# EAGLE design base_pwr1.0 (EAGLE 5.00)

## Sheet 1 of 2
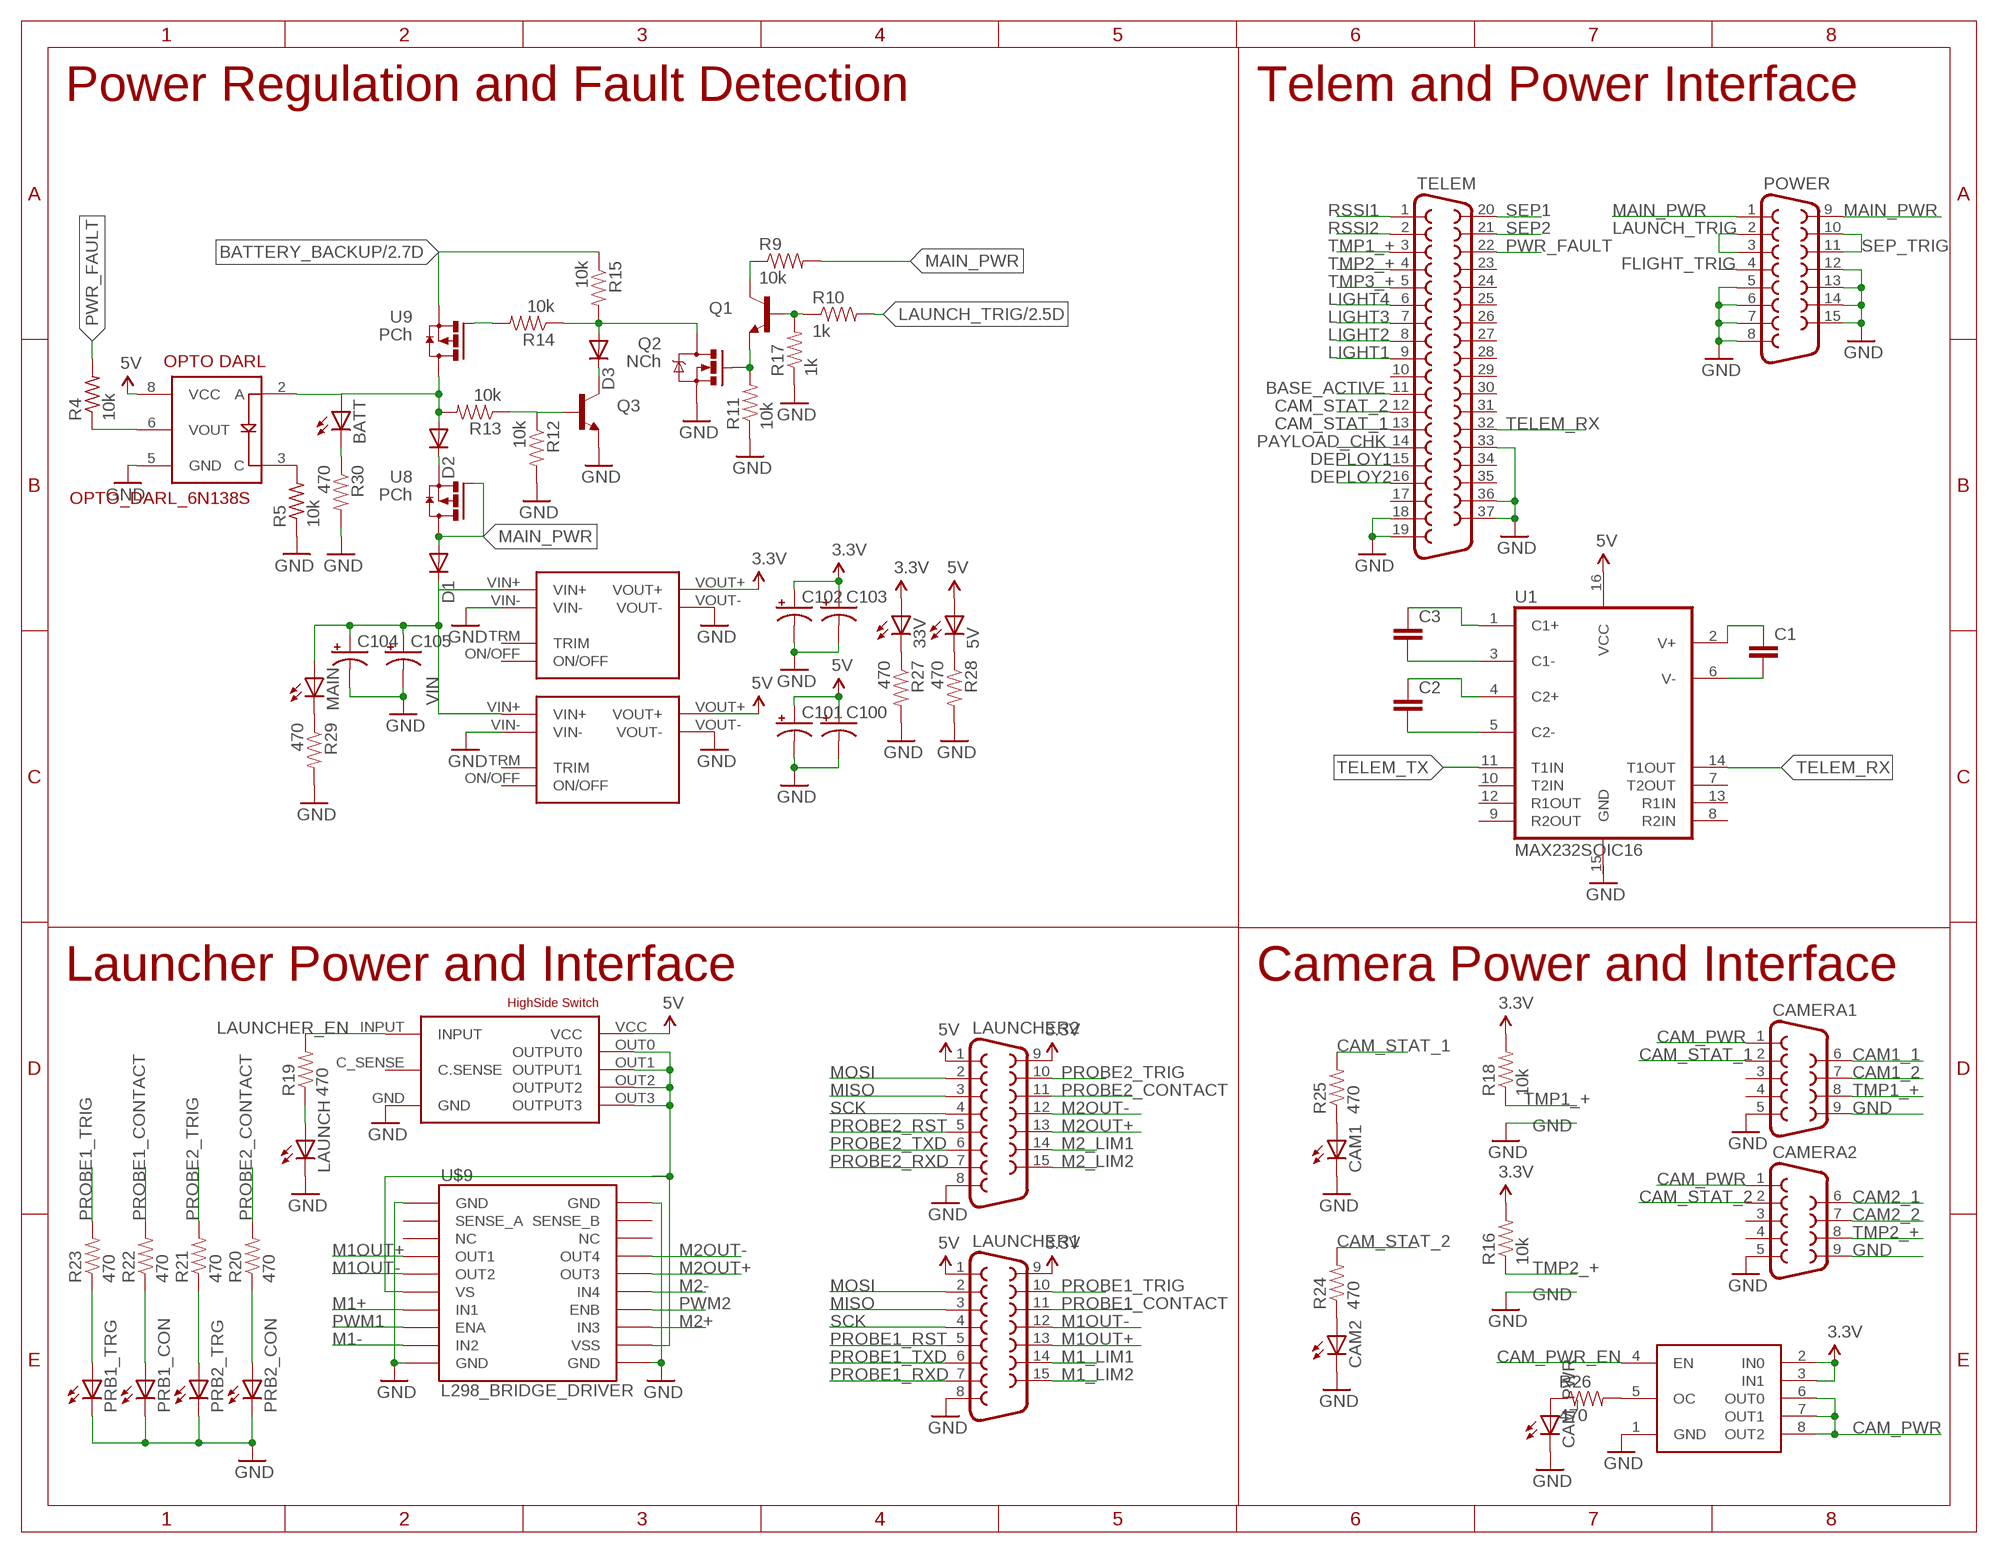
[diagram p0: schematic, sheet 1]

### Parts
3.3V  UEI15-033-Q12  [UEI15]
5.0V  UEI15-050-Q12  [UEI15]
5V  LEDCHIP-LED0805  [CHIP-LED0805]
33V  LEDCHIP-LED0805  [CHIP-LED0805]
BATT  LEDCHIP-LED0805  [CHIP-LED0805]
C1  CAP0805  [0805]
C2  CAP0805  [0805]
C3  CAP0805  [0805]
C100  CAP_POLF80  [NIPPON_F80]
C101  CAP_POLF80  [NIPPON_F80]
C102  CAP_POLF80  [NIPPON_F80]
C103  CAP_POLF80  [NIPPON_F80]
C104  CAP_POLF80  [NIPPON_F80]
C105  CAP_POLF80  [NIPPON_F80]
CAM1  LEDCHIP-LED0805  [CHIP-LED0805]
CAM2  LEDCHIP-LED0805  [CHIP-LED0805]
CAM_PWR  LEDCHIP-LED0805  [CHIP-LED0805]
CAMERA1  F09VB  [F09VB]
CAMERA2  F09VB  [F09VB]
D1  DIODE-SMC  [SMC]
D2  DIODE-SMC  [SMC]
D3  DIODESOD  [SOD-323]
LAUNCH  LEDCHIP-LED0805  [CHIP-LED0805]
LAUNCHER1  F15VB  [F15VB]
LAUNCHER2  F15VB  [F15VB]
MAIN  LEDCHIP-LED0805  [CHIP-LED0805]
POWER  F15VB  [F15VB]
PRB1_CON  LEDCHIP-LED0805  [CHIP-LED0805]
PRB1_TRG  LEDCHIP-LED0805  [CHIP-LED0805]
PRB2_CON  LEDCHIP-LED0805  [CHIP-LED0805]
PRB2_TRG  LEDCHIP-LED0805  [CHIP-LED0805]
Q1  TRANSISTOR_NPNSOT23-3  [SOT23-3]
Q2  NCh  MOSFET-NCHANNELSMD  [SOT23-3]
Q3  TRANSISTOR_NPNSOT23-3  [SOT23-3]
R4  10k  R-US_M0805  [M0805]
R5  10k  R-US_M0805  [M0805]
R9  10k  RESISTOR  [0805]
R10  1k  RESISTOR  [0805]
R11  10k  RESISTOR  [0805]
R12  10k  RESISTOR  [0805]
R13  10k  RESISTOR  [0805]
R14  10k  RESISTOR  [0805]
R15  10k  RESISTOR  [0805]
R16  10k  RESISTOR  [0805]
R17  1k  RESISTOR  [0805]
R18  10k  RESISTOR  [0805]
R19  470  RESISTOR  [0805]
R20  470  RESISTOR  [0805]
R21  470  RESISTOR  [0805]
R22  470  RESISTOR  [0805]
R23  470  RESISTOR  [0805]
R24  470  RESISTOR  [0805]
R25  470  RESISTOR  [0805]
R26  470  RESISTOR  [0805]
R27  470  RESISTOR  [0805]
R28  470  RESISTOR  [0805]
R29  470  RESISTOR  [0805]
R30  470  RESISTOR  [0805]
TELEM  F37VB  [F37VB]
U1  MAX232SOIC16  [SO016]
U5  OPTO_DARL_6N138S  [8-SMD]
U6  TPS2034D  [SO-08]
U7  VN920SP  [POWERS0-10]
U8  PCh  IRFR5505  [D-PAK_TO252AA]
U9  PCh  IRFR5505  [D-PAK_TO252AA]
U$9  L298_BRIDGE_DRIVER  [POWERSO20]

### Nets
3.3V: 3.3V.VOUT+ 33V.A C102.+ C103.+ LAUNCHER1.9 LAUNCHER2.9 R16.2 R18.2 U6.2(IN0) U6.3(IN1) ; also sheet 2
5V: 5.0V.VOUT+ 5V.A C100.+ C101.+ LAUNCHER1.1 LAUNCHER2.1 U1.16(VCC) U5.8(VCC) U7.VCC ; also sheet 2
BASE_ACTIVE: TELEM.11
BATTERY_BACKUP: R15.1 U9.3(S) ; also sheet 2
CAM1_1: CAMERA1.6 ; also sheet 2
CAM1_2: CAMERA1.7 ; also sheet 2
CAM2_1: CAMERA2.6 ; also sheet 2
CAM2_2: CAMERA2.7 ; also sheet 2
CAM_PWR: CAMERA1.1 CAMERA2.1 U6.6(OUT0) U6.7(OUT1) U6.8(OUT2)
CAM_PWR_EN: U6.4(EN) ; also sheet 2
CAM_STAT_1: CAMERA1.2 R25.2 TELEM.13 ; also sheet 2
CAM_STAT_2: CAMERA2.2 R24.2 TELEM.12 ; also sheet 2
DEPLOY1: TELEM.15 ; also sheet 2
DEPLOY2: TELEM.16 ; also sheet 2
FLIGHT_TRIG: POWER.4 ; also sheet 2
GND: 3.3V.VIN- 3.3V.VOUT- 5.0V.VIN- 5.0V.VOUT- C100.- C101.- C102.- C103.- C104.- C105.- CAM1.C CAM2.C CAM_PWR.C CAMERA1.5 CAMERA1.9 CAMERA2.5 CAMERA2.9 LAUNCH.C LAUNCHER1.8 LAUNCHER2.8 POWER.5 POWER.6 POWER.7 POWER.8 POWER.12 POWER.13 POWER.14 POWER.15 PRB1_CON.C PRB1_TRG.C PRB2_CON.C PRB2_TRG.C Q2.2(S) Q3.2(E) R5.1 R11.1 R12.2 R17.1 R27.2 R28.2 R29.2 R30.2 TELEM.18 TELEM.19 TELEM.33 TELEM.36 TELEM.37 U5.5(GND) U6.1(GND) U7.GND U$9.P$1(GND) U$9.P$10(GND) U$9.P$11(GND) U$9.P$20(GND) ; also sheet 2
LAUNCH_TRIG: POWER.2 POWER.3 R10.2 ; also sheet 2
LAUNCHER_EN: R19.2 U7.INPUT ; also sheet 2
LIGHT1: TELEM.9 ; also sheet 2
LIGHT2: TELEM.8 ; also sheet 2
LIGHT3: TELEM.7 ; also sheet 2
LIGHT4: TELEM.6 ; also sheet 2
M1+: U$9.P$7(IN1) ; also sheet 2
M1-: U$9.P$9(IN2) ; also sheet 2
M1_LIM1: LAUNCHER1.14 ; also sheet 2
M1_LIM2: LAUNCHER1.15 ; also sheet 2
M1OUT+: LAUNCHER1.13 U$9.P$4(OUT1)
M1OUT-: LAUNCHER1.12 U$9.P$5(OUT2)
M2+: U$9.P$13(IN3) ; also sheet 2
M2-: U$9.P$15(IN4) ; also sheet 2
M2_LIM1: LAUNCHER2.14 ; also sheet 2
M2_LIM2: LAUNCHER2.15 ; also sheet 2
M2OUT+: LAUNCHER2.13 U$9.P$16(OUT3)
M2OUT-: LAUNCHER2.12 U$9.P$17(OUT4)
MAIN_PWR: D1.A POWER.1 POWER.9 R9.2 U8.1(G) U8.4(D)
MISO: LAUNCHER1.3 LAUNCHER2.3 ; also sheet 2
MOSI: LAUNCHER1.2 LAUNCHER2.2 ; also sheet 2
N$1: R26.2 U6.5(OC)
N$2: CAM_PWR.A R26.1
N$3: CAM1.A R25.1
N$4: CAM2.A R24.1
N$6: Q1.2(E) Q2.1(G) R11.2
N$7: R5.2 U5.3(C)
N$8: D2.C U8.3(S)
N$9: R4.1 U5.6(VOUT)
N$16: Q1.3(C) R9.1
N$18: Q1.1(B) R10.1 R17.2
N$19: D3.1(C) Q3.3(C)
N$23: R14.2 U9.1(G)
N$25: U7.OUT0(OUTPUT0) U7.OUT1(OUTPUT1) U7.OUT2(OUTPUT2) U7.OUT3(OUTPUT3) U$9.P$6(VS) U$9.P$12(VSS)
N$26: Q3.1(B) R12.1 R13.1
N$44: D3.2(A) Q2.3(D) R14.1 R15.2
N$48: 33V.C R27.1
N$49: 5V.C R28.1
N$50: MAIN.C R29.1
N$51: BATT.C R30.1
N$52: LAUNCH.A R19.1
N$54: C3.1 U1.1(C1+)
N$55: C3.2 U1.3(C1-)
N$56: C2.2 U1.5(C2-)
N$57: C2.1 U1.4(C2+)
N$58: C1.1 U1.2(V+)
N$59: C1.2 U1.6(V-)
N$60: PRB1_TRG.A R23.1
N$61: PRB1_CON.A R22.1
N$62: PRB2_TRG.A R21.1
N$63: PRB2_CON.A R20.1
PAYLOAD_CHK: TELEM.14 ; also sheet 2
PROBE1_CONTACT: LAUNCHER1.11 R22.2 ; also sheet 2
PROBE1_RST: LAUNCHER1.5 ; also sheet 2
PROBE1_RXD: LAUNCHER1.7 ; also sheet 2
PROBE1_TRIG: LAUNCHER1.10 R23.2 ; also sheet 2
PROBE1_TXD: LAUNCHER1.6 ; also sheet 2
PROBE2_CONTACT: LAUNCHER2.11 R20.2 ; also sheet 2
PROBE2_RST: LAUNCHER2.5 ; also sheet 2
PROBE2_RXD: LAUNCHER2.7 ; also sheet 2
PROBE2_TRIG: LAUNCHER2.10 R21.2 ; also sheet 2
PROBE2_TXD: LAUNCHER2.6 ; also sheet 2
PWM1: U$9.P$8(ENA) ; also sheet 2
PWM2: U$9.P$14(ENB) ; also sheet 2
PWR_FAULT: R4.2 TELEM.22 ; also sheet 2
RSSI1: TELEM.1 ; also sheet 2
RSSI2: TELEM.2 ; also sheet 2
SCK: LAUNCHER1.4 LAUNCHER2.4 ; also sheet 2
SEP1: TELEM.20 ; also sheet 2
SEP2: TELEM.21 ; also sheet 2
SEP_TRIG: BATT.A D2.A POWER.10 POWER.11 R13.2 U5.2(A) U9.4(D) ; also sheet 2
TELEM_RX: TELEM.32 U1.14(T1OUT)
TELEM_TX: U1.11(T1IN) ; also sheet 2
TMP1_+: CAMERA1.8 R18.1 TELEM.3
TMP2_+: CAMERA2.8 R16.1 TELEM.4
TMP3_+: TELEM.5
VIN: 3.3V.VIN+ 5.0V.VIN+ C104.+ C105.+ D1.C MAIN.A
Unconnected: 3.3V.ON/OFF 3.3V.TRM(TRIM) 5.0V.ON/OFF 5.0V.TRM(TRIM) CAMERA1.3 CAMERA1.4 CAMERA2.3 CAMERA2.4 TELEM.10 TELEM.17 TELEM.23 TELEM.24 TELEM.25 TELEM.26 TELEM.27 TELEM.28 TELEM.29 TELEM.30 TELEM.31 TELEM.34 TELEM.35 U1.7(T2OUT) U1.8(R2IN) U1.9(R2OUT) U1.10(T2IN) U1.12(R1OUT) U1.13(R1IN) U1.15(GND) U7.C_SENSE(C.SENSE) U$9.P$2(SENSE_A) U$9.P$3(NC) U$9.P$18(NC) U$9.P$19(SENSE_B)

### Notes on the sheet
- Power Regulation and Fault Detection | Telem and Power Interface
- Launcher Power and Interface | Camera Power and Interface

## Sheet 2 of 2
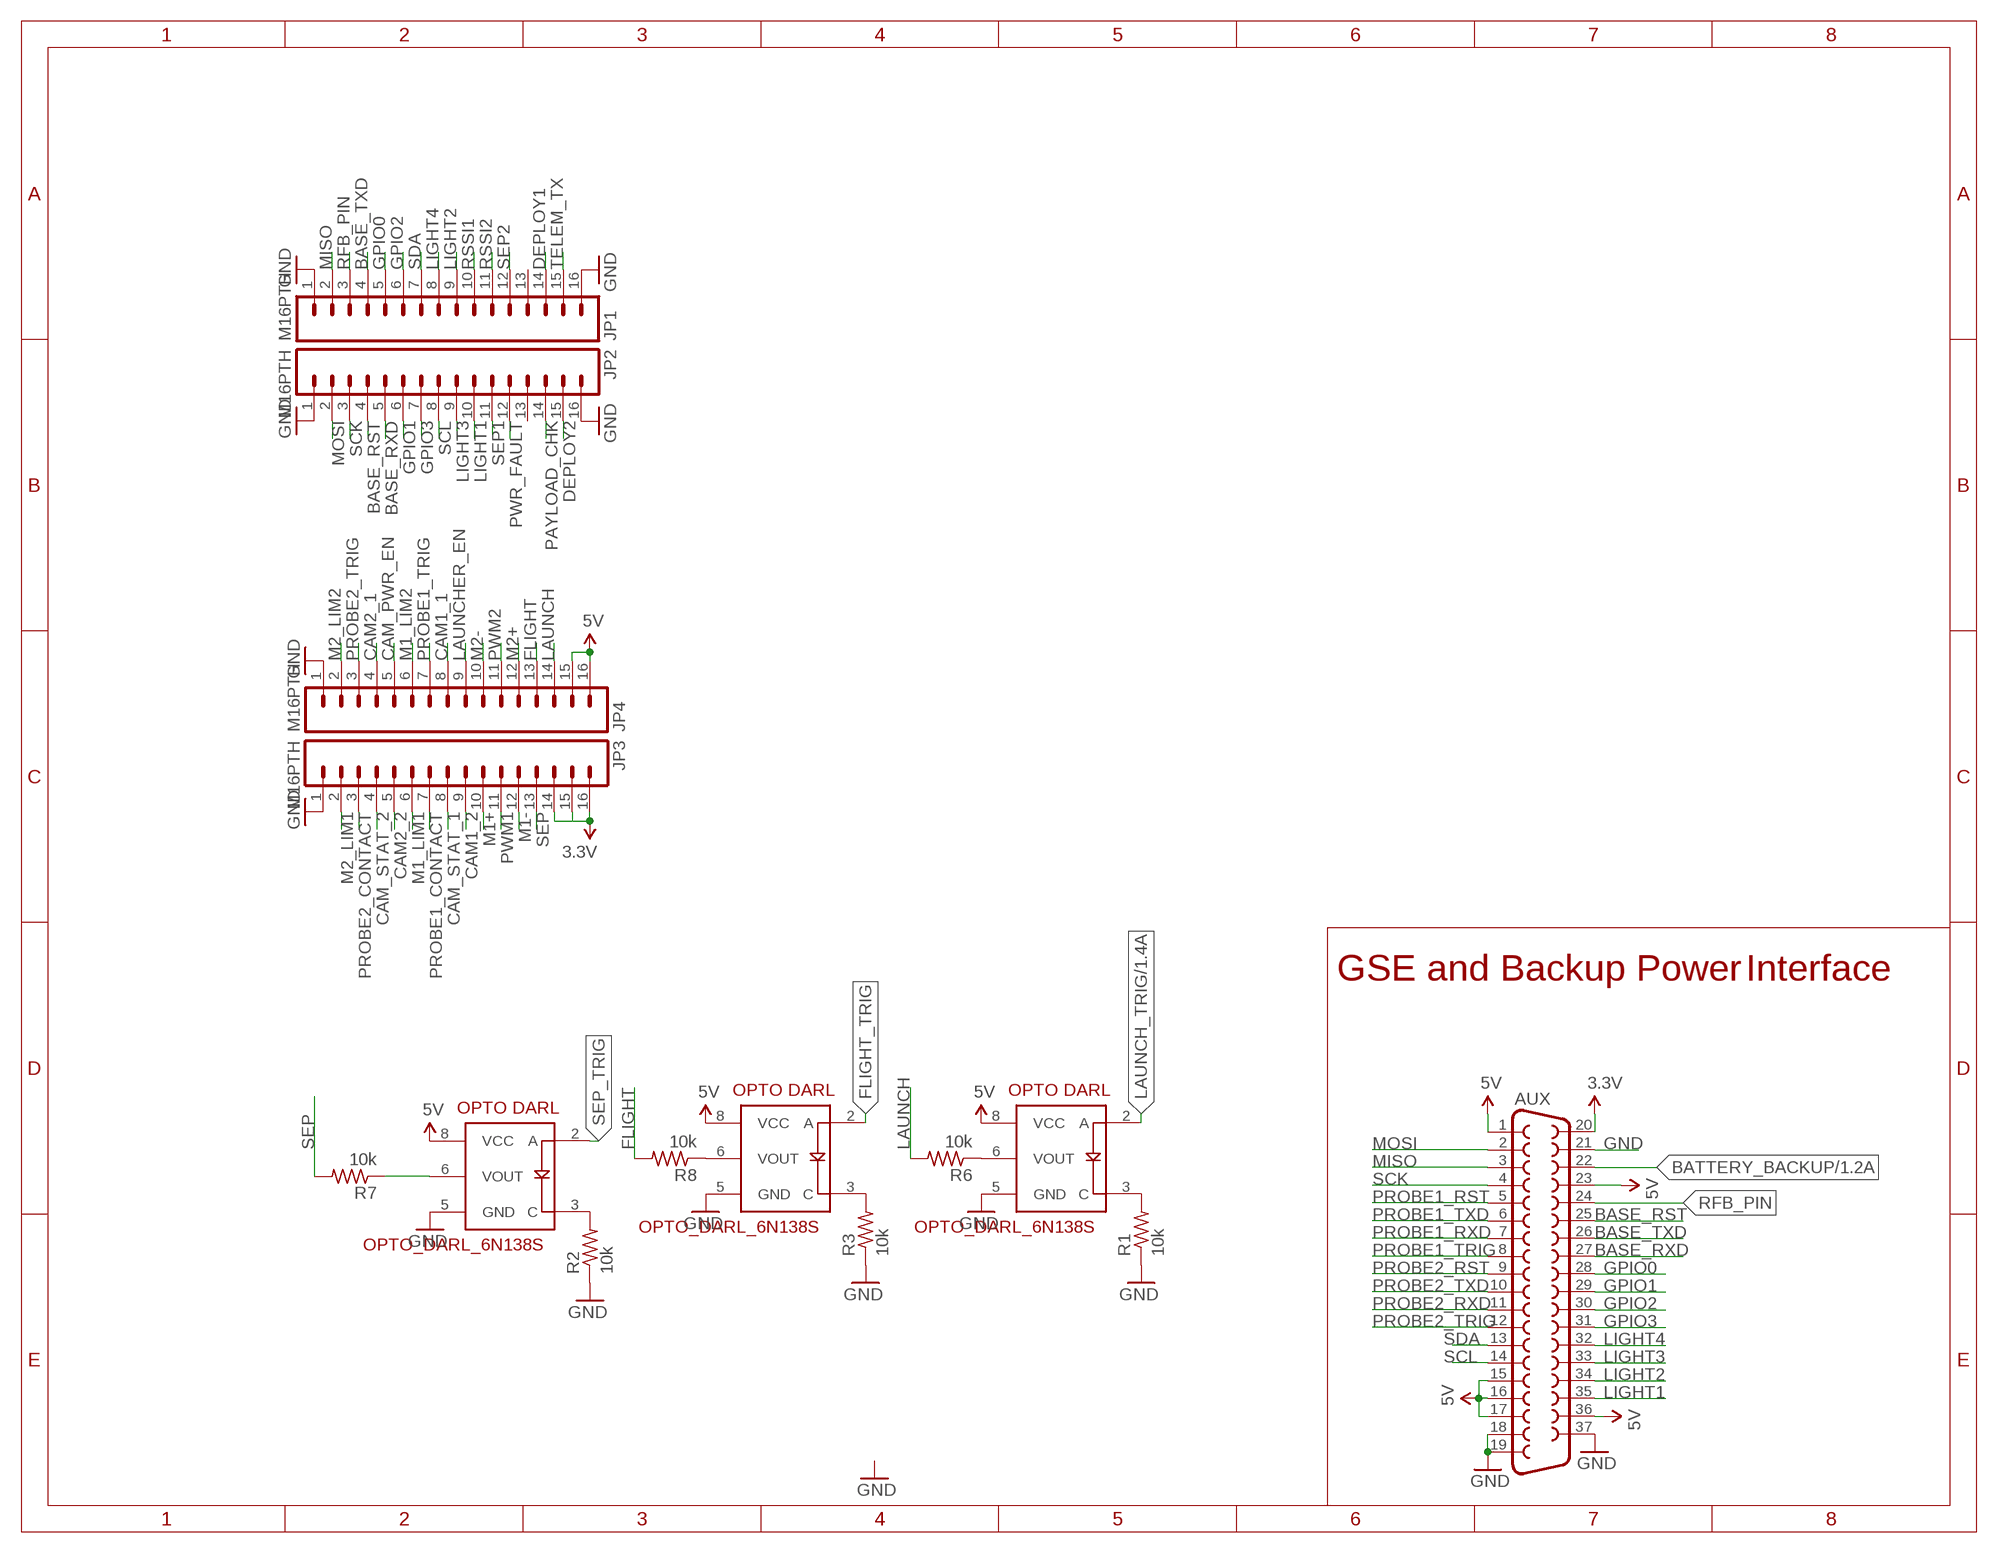
[diagram p1: schematic, sheet 2]

### Parts
AUX  F37VB  [F37VB]
JP1  M16PTH  [1X16]
JP2  M16PTH  [1X16]
JP3  M16PTH  [1X16]
JP4  M16PTH  [1X16]
R1  10k  R-US_M0805  [M0805]
R2  10k  R-US_M0805  [M0805]
R3  10k  R-US_M0805  [M0805]
R6  10k  R-US_M0805  [M0805]
R7  10k  R-US_M0805  [M0805]
R8  10k  R-US_M0805  [M0805]
U2  OPTO_DARL_6N138S  [8-SMD]
U3  OPTO_DARL_6N138S  [8-SMD]
U4  OPTO_DARL_6N138S  [8-SMD]

### Nets
3.3V: AUX.20 JP3.14 JP3.15 JP3.16 ; also sheet 1
5V: AUX.1 AUX.15 AUX.16 AUX.17 AUX.23 AUX.36 JP4.15 JP4.16 U2.8(VCC) U3.8(VCC) U4.8(VCC) ; also sheet 1
BASE_RST: AUX.25 JP2.4
BASE_RXD: AUX.27 JP2.5
BASE_TXD: AUX.26 JP1.4
BATTERY_BACKUP: AUX.22 ; also sheet 1
CAM1_1: JP4.8 ; also sheet 1
CAM1_2: JP3.9 ; also sheet 1
CAM2_1: JP4.4 ; also sheet 1
CAM2_2: JP3.5 ; also sheet 1
CAM_PWR_EN: JP4.5 ; also sheet 1
CAM_STAT_1: JP3.8 ; also sheet 1
CAM_STAT_2: JP3.4 ; also sheet 1
DEPLOY1: JP1.14 ; also sheet 1
DEPLOY2: JP2.15 ; also sheet 1
FLIGHT: JP4.13 R8.2
FLIGHT_TRIG: U4.2(A) ; also sheet 1
GND: AUX.18 AUX.19 AUX.21 AUX.37 JP1.1 JP1.16 JP2.1 JP2.16 JP3.1 JP4.1 R1.1 R2.1 R3.1 U2.5(GND) U3.5(GND) U4.5(GND) ; also sheet 1
GPIO0: AUX.28 JP1.5
GPIO1: AUX.29 JP2.6
GPIO2: AUX.30 JP1.6
GPIO3: AUX.31 JP2.7
LAUNCH: JP4.14 R6.2
LAUNCH_TRIG: U2.2(A) ; also sheet 1
LAUNCHER_EN: JP4.9 ; also sheet 1
LIGHT1: AUX.35 JP2.10 ; also sheet 1
LIGHT2: AUX.34 JP1.9 ; also sheet 1
LIGHT3: AUX.33 JP2.9 ; also sheet 1
LIGHT4: AUX.32 JP1.8 ; also sheet 1
M1+: JP3.10 ; also sheet 1
M1-: JP3.12 ; also sheet 1
M1_LIM1: JP3.6 ; also sheet 1
M1_LIM2: JP4.6 ; also sheet 1
M2+: JP4.12 ; also sheet 1
M2-: JP4.10 ; also sheet 1
M2_LIM1: JP3.2 ; also sheet 1
M2_LIM2: JP4.2 ; also sheet 1
MISO: AUX.3 JP1.2 ; also sheet 1
MOSI: AUX.2 JP2.2 ; also sheet 1
N$38: R1.2 U2.3(C)
N$39: R3.2 U4.3(C)
N$40: R2.2 U3.3(C)
N$41: R7.1 U3.6(VOUT)
N$43: R6.1 U2.6(VOUT)
N$64: R8.1 U4.6(VOUT)
PAYLOAD_CHK: JP2.14 ; also sheet 1
PROBE1_CONTACT: JP3.7 ; also sheet 1
PROBE1_RST: AUX.5 ; also sheet 1
PROBE1_RXD: AUX.7 ; also sheet 1
PROBE1_TRIG: AUX.8 JP4.7 ; also sheet 1
PROBE1_TXD: AUX.6 ; also sheet 1
PROBE2_CONTACT: JP3.3 ; also sheet 1
PROBE2_RST: AUX.9 ; also sheet 1
PROBE2_RXD: AUX.11 ; also sheet 1
PROBE2_TRIG: AUX.12 JP4.3 ; also sheet 1
PROBE2_TXD: AUX.10 ; also sheet 1
PWM1: JP3.11 ; also sheet 1
PWM2: JP4.11 ; also sheet 1
PWR_FAULT: JP2.12 ; also sheet 1
RFB_PIN: AUX.24 JP1.3
RSSI1: JP1.10 ; also sheet 1
RSSI2: JP1.11 ; also sheet 1
SCK: AUX.4 JP2.3 ; also sheet 1
SCL: AUX.14 JP2.8
SDA: AUX.13 JP1.7
SEP: JP3.13 R7.2
SEP1: JP2.11 ; also sheet 1
SEP2: JP1.12 ; also sheet 1
SEP_TRIG: U3.2(A) ; also sheet 1
TELEM_TX: JP1.15 ; also sheet 1
Unconnected: JP1.13 JP2.13

### Notes on the sheet
- GSE and Backup Power | Interface

## Library data of the parts
3.3V = muRata:UEI15-033-Q12; VOLTAGE: 3.3v
5.0V = muRata:UEI15-050-Q12; VOLTAGE: 5.0v
5V 33V BATT CAM1 CAM2 CAM_PWR LAUNCH MAIN PRB1_CON PRB1_TRG PRB2_CON PRB2_TRG = led:LED: LED OSRAM: - CHIPLED LG R971, LG N971, LY N971, LG Q971, LY Q971, LO R971, LY R971 LH N974, LH R974 LS Q976, LO Q976, LY Q976 LO Q996 - Hyper CHIPLED LW Q18S LB Q993, LB Q99A, LB R99A - SideLED LS A670, LO A670, LY A670, LG A670, LP A670 LB A673, LV A673, LT A673, LW A673 LH A674 LY A675 LS A676, LA A676, LO A676, LY A676, LW A676 LS A679, LY A679, LG A679 - Hyper Micro SIDELED® LS Y876, LA Y876, LO Y876, LY Y876 LT Y87S - SmartLED LW L88C, LW L88S LB L89C, LB L89S, LG L890 LS L89K, LO L89K, LY L89K LS L896, LA L896, LO L896, LY L896 - TOPLED LS T670, LO T670, LY T670, LG T670, LP T670 LSG T670, LSP T670, LSY T670, LOP T670, LYG T670 LG T671, LOG T671, LSG T671 LB T673, LV T673, LT T673, LW T673 LH T674 LS T676, LA T676, LO T676, LY T676, LB T676, LH T676, LSB T676, LW T676 LB T67C, LV T67C, LT T67C, LS T67K, LO T67K, LY T67K, LW E67C LS E67B, LA E67B, LO E67B, LY E67B, LB E67C, LV E67C, LT E67C LW T67C LS T679, LY T679, LG T679 LS T770, LO T770, LY T770, LG T770, LP T770 LB T773, LV T773, LT T773, LW T773 LH T774 LS E675, LA E675, LY E675, LS T675 LS T776, LA T776, LO T776, LY T776, LB T776 LHGB T686 LT T68C, LB T68C - Hyper Mini TOPLED® LB M676 - Mini TOPLED Santana® LG M470 LS M47K, LO M47K, LY M47K Source: http://www.osram.convergy.de LUXEON: - LUMILED® LXK2-PW12-R00, LXK2-PW12-S00, LXK2-PW14-U00, LXK2-PW14-V00 LXK2-PM12-R00, LXK2-PM12-S00, LXK2-PM14-U00 LXK2-PE12-Q00, LXK2-PE12-R00, LXK2-PE12-S00, LXK2-PE14-T00, LXK2-PE14-U00 LXK2-PB12-K00, LXK2-PB12-L00, LXK2-PB12-M00, LXK2-PB14-N00, LXK2-PB14-P00, LXK2-PB14-Q00 LXK2-PR12-L00, LXK2-PR12-M00, LXK2-PR14-Q00, LXK2-PR14-R00 LXK2-PD12-Q00, LXK2-PD12-R00, LXK2-PD12-S00 LXK2-PH12-R00, LXK2-PH12-S00 LXK2-PL12-P00, LXK2-PL12-Q00, LXK2-PL12-R00 Source: www.luxeon.com KINGBRIGHT: KA-3528ASYC Source: www.kingbright.com
AUX TELEM = con-subd:F37: SUB-D
C1-C3 = SparkFun:CAP: Capacitor Standard 0603 ceramic capacitor, and 0.1" leaded capacitor.
C100-C105 = SparkFun:CAP_POL: Capacitor Polarized These are standard SMD and PTH capacitors. Normally 10uF, 47uF, and 100uF in electrolytic and tantalum varieties. Always verify the external diameter of the through hole cap, it varies with capacity, voltage, and manufacturer. The EIA devices should be standard.
CAMERA1 CAMERA2 = con-subd:F09: SUB-D
D1 D2 = diode:DIODE-: DIODE
D3 = SparkFun:DIODE: Diode These are standard reverse protection diodes and small signal diodes. SMA package can handle up to about 1A. SOD-323 can handle about 200mA. What the SOD-323 package when ordering, there are some mfgs out there that are 5-pin packages.
JP1-JP4 = SparkFun:M16
LAUNCHER1 LAUNCHER2 POWER = con-subd:F15: SUB-D
Q1 Q3 = SparkFun:TRANSISTOR_NPN: Transistor NPN BJT configuration in SOT23 package. MMBT2222 is the common NPN we use. Double check BCE configuration again layout.
Q2 = SparkFun:MOSFET-NCHANNEL
R1-R8 = rcl:R-US_: RESISTOR, American symbol
R9-R30 = SparkFun:RESISTOR: Resistor Basic schematic elements and footprints for 0603, 1206, and PTH 1/10th watt (small) resistors.
U1 = SparkFun:MAX232: RS232 Transceiver Very common IC. This is generically called 'MAX232', but works with the 3V equivalent MAX3232 generic ICs. Field tested and mother approved. Spark Fun Electronics SKU : COM-00316 (DIP) and COM-00589 (SMD)
U2-U5 = SparkFun:OPTO_DARL_6N138S
U6 = texas:TPS2034D
U7 = rocketsat:VN920SP
U8 U9 = transistor-power:IRFR5505
U$9 = SparkFun:L298_BRIDGE_DRIVER

## Board
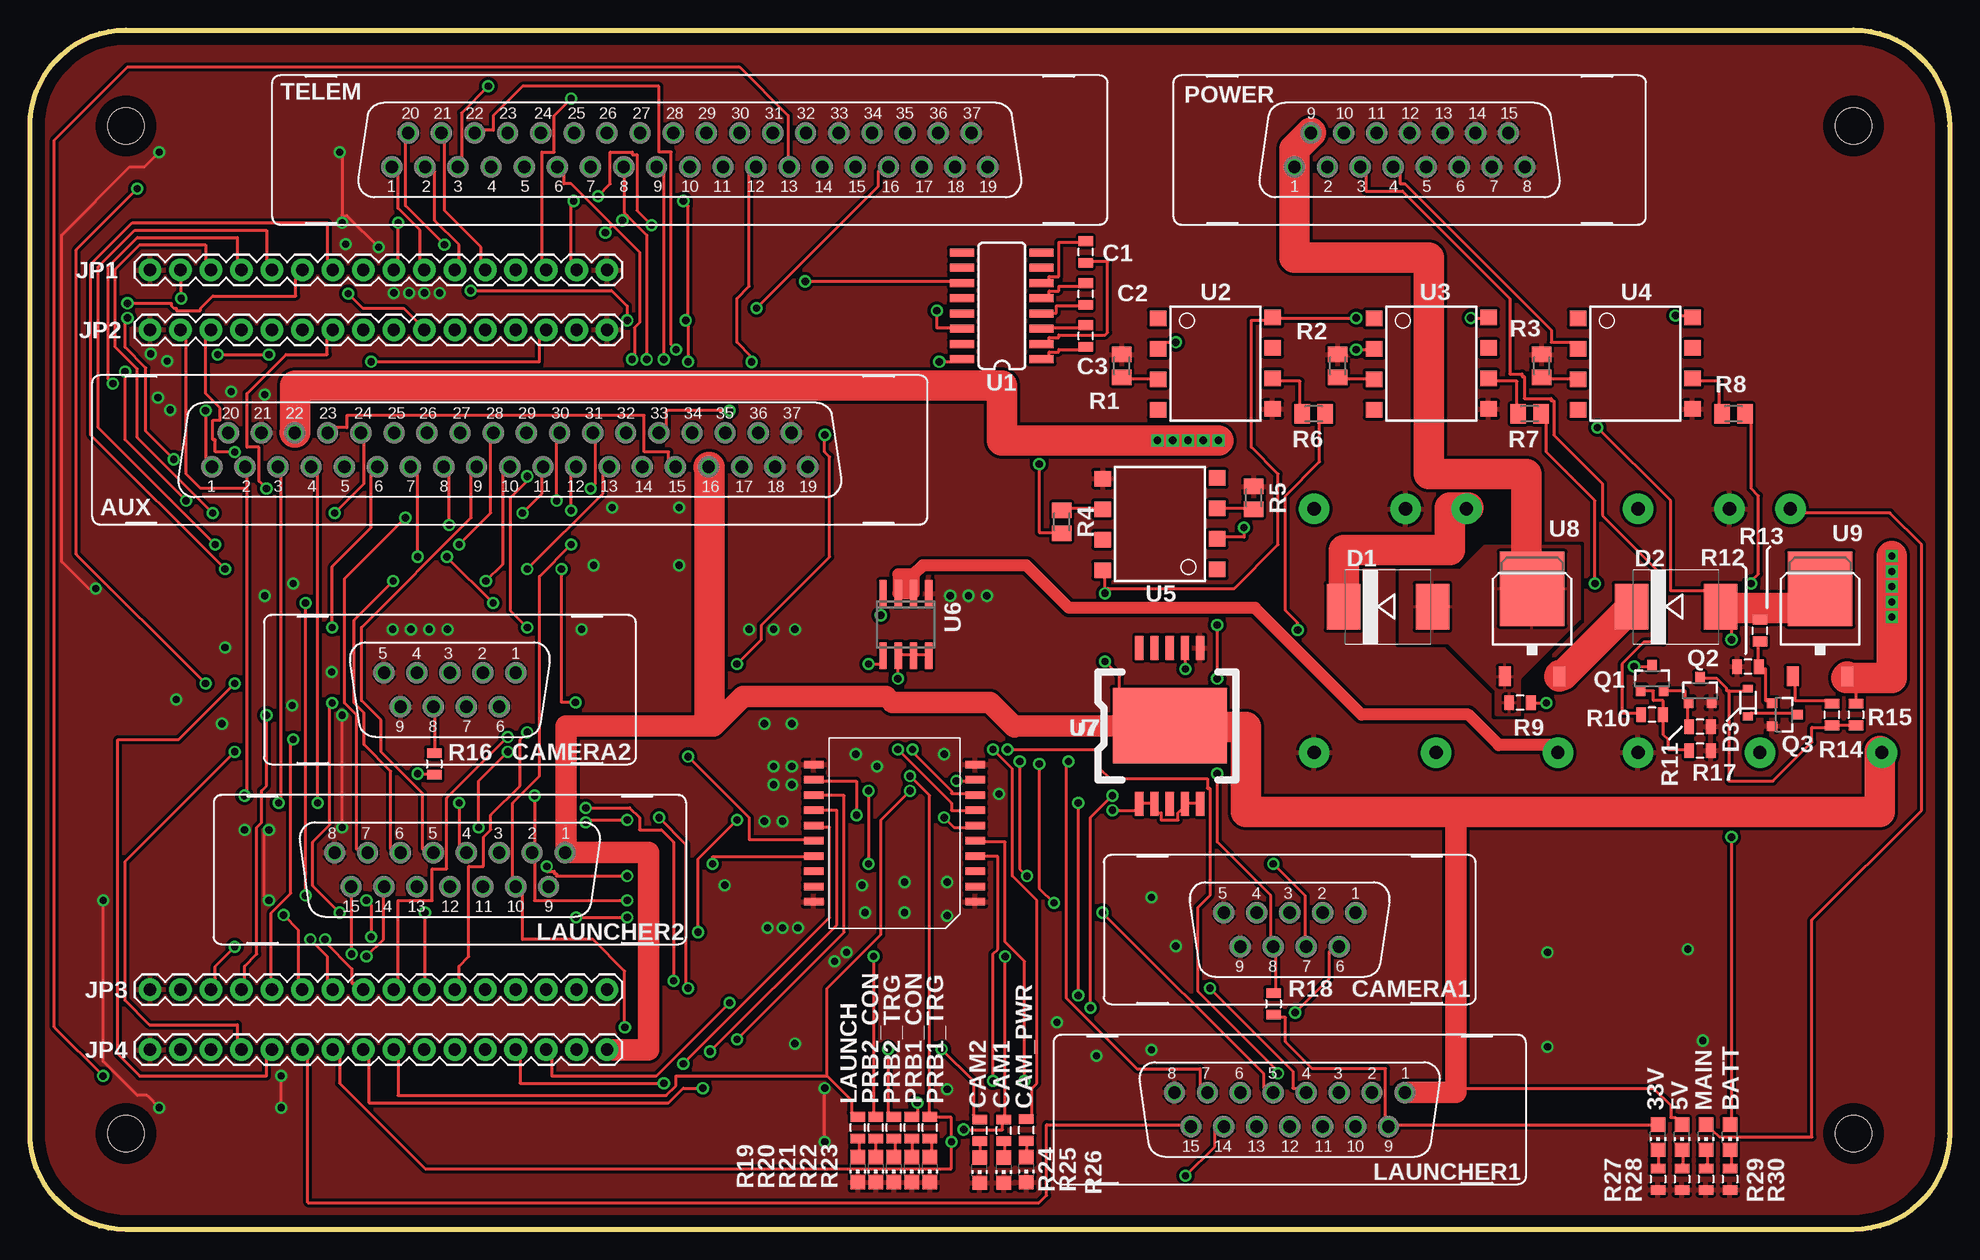
[diagram p2: board, top side]
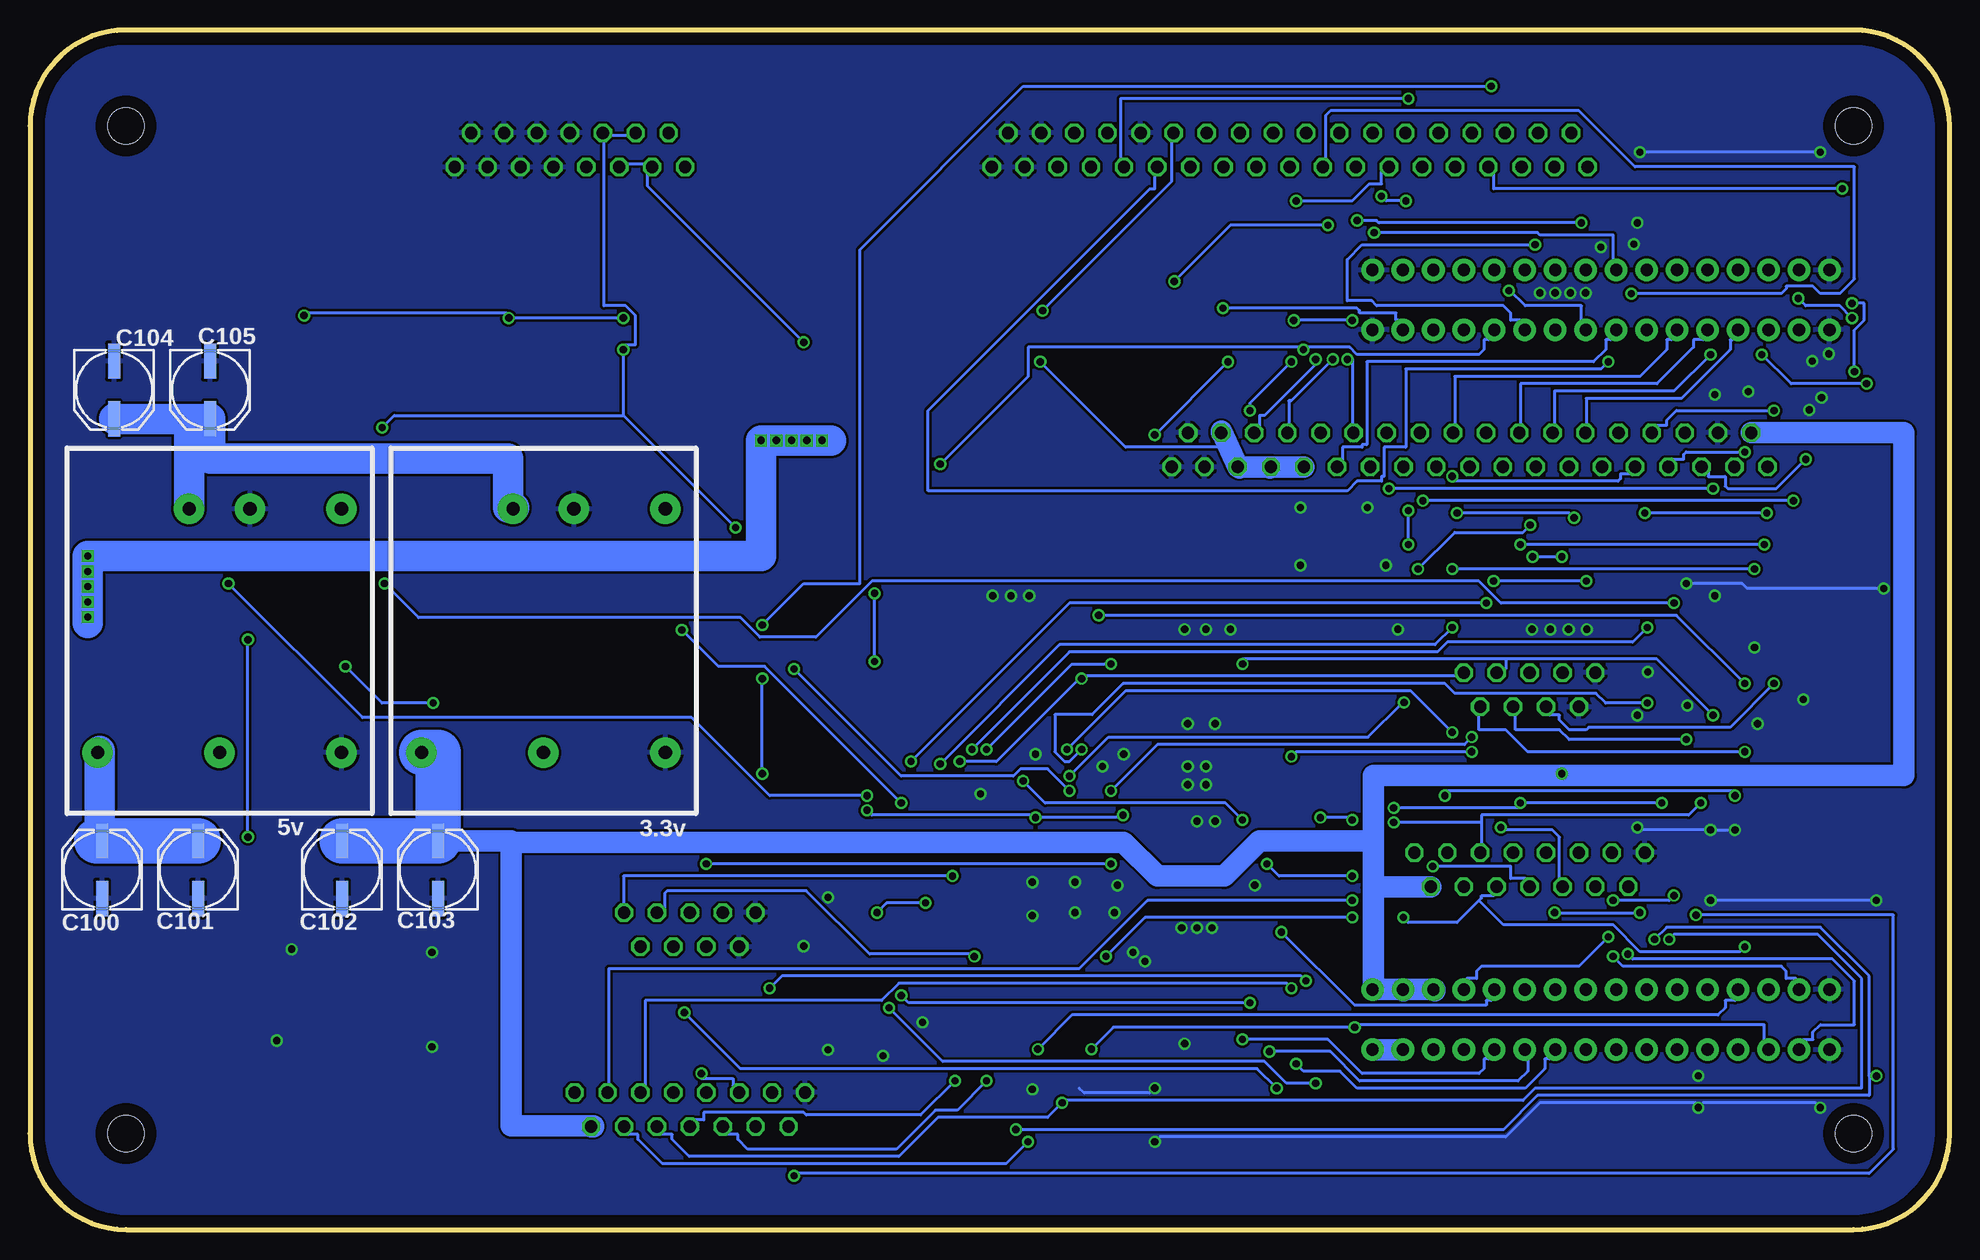
[diagram p3: board, bottom side, seen from below]

Size 160 x 100 mm. Coordinates in mm from the lower left corner, seen from the top.
Outline: 8,0 arc-90 0,8 0,92 arc-90 8,100 152,100 arc-90 160,92 160,8 arc-90 152,0 8,0
Copper layers (1*16): Top 0.035mm / dielectric 1.5mm / Bottom 0.035mm
Design rules "default *": minimum track width 10mil, minimum drill 24mil, track to track 8mil, track to pad 8mil, pad to pad 8mil, via to via 8mil, smd to smd 8mil, copper to edge 40mil, drill to drill 8mil, minimum pad ring 10mil, minimum via ring 8mil, stop-mask expansion 4mil, vias tented up to drill 25mil, thermal gap 10mil
Holes 3 mm at 8,8 152,8 152,92 8,92

### Footprints (pad centres in the part's own frame; a part is rotated, then mirrored left to right if it is on the bottom)
UEI15 = drill 1.1 pad 2.54 round: ON/OFF 10.16,-10.16; TRM -10.16,0; VIN+ 10.16,2.54; VIN- 10.16,-2.54; VOUT+ -10.16,10.16; VOUT- -10.16,-10.16
CHIP-LED0805 = smd 1.2 x 1.2: A 0,-1.05; C 0,1.05
F37VB = drill 1.016 octagon: 1 -24.841,-1.422; 2 -22.073,-1.422; 3 -19.329,-1.422; 4 -16.561,-1.422; 5 -13.792,-1.422; 6 -11.049,-1.422; 7 -8.28,-1.422; 8 -5.512,-1.422; 9 -2.769,-1.422; 10 0,-1.422; 11 2.769,-1.422; 12 5.512,-1.422; 13 8.28,-1.422; 14 11.049,-1.422; 15 13.818,-1.422; 16 16.561,-1.422; 17 19.329,-1.422; 18 22.098,-1.422; 19 24.841,-1.422; 20 -23.47,1.422; 21 -20.701,1.422; 22 -17.932,1.422; 23 -15.189,1.422; 24 -12.421,1.422; 25 -9.652,1.422; 26 -6.909,1.422; 27 -4.14,1.422; 28 -1.372,1.422; 29 1.372,1.422; 30 4.14,1.422; 31 6.909,1.422; 32 9.677,1.422; 33 12.421,1.422; 34 15.189,1.422; 35 17.958,1.422; 36 20.701,1.422; 37 23.47,1.422
0805 = smd 0.8 x 1.2: 1 -0.9,0; 2 0.9,0
NIPPON_F80 = smd 2.95 x 1: + 2.4,0; - -2.4,0
F09VB = drill 1.016 octagon: 1 -5.486,-1.422; 2 -2.743,-1.422; 3 0,-1.422; 4 2.743,-1.422; 5 5.486,-1.422; 6 -4.115,1.422; 7 -1.372,1.422; 8 1.372,1.422; 9 4.115,1.422
SMC = smd 2.8 x 3.8: A 3.7,0; C -3.7,0
SOD-323 = smd 0.63 x 0.83: 1 -1.15,0; 2 1.15,0
1X16 = drill 1.016 pad 1.88 round: 1 0,0; 2 2.54,0; 3 5.08,0; 4 7.62,0; 5 10.16,0; 6 12.7,0; 7 15.24,0; 8 17.78,0; 9 20.32,0; 10 22.86,0; 11 25.4,0; 12 27.94,0; 13 30.48,0; 14 33.02,0; 15 35.56,0; 16 38.1,0
F15VB = drill 1.016 octagon: 1 -9.601,-1.422; 2 -6.858,-1.422; 3 -4.115,-1.422; 4 -1.372,-1.422; 5 1.372,-1.422; 6 4.115,-1.422; 7 6.858,-1.422; 8 9.601,-1.422; 9 -8.23,1.422; 10 -5.486,1.422; 11 -2.743,1.422; 12 0,1.422; 13 2.743,1.422; 14 5.486,1.422; 15 8.23,1.422
SOT23-3 = smd 0.8 x 0.9: 1 -0.95,-1; 2 0.95,-1; 3 0,1.1
M0805 = smd 1.3 x 1.6: 1 -0.95,0; 2 0.95,0
SO016 = smd 0.66 x 2.032: 1 -4.445,-3.315; 2 -3.175,-3.315; 3 -1.905,-3.315; 4 -0.635,-3.315; 5 0.635,-3.315; 6 1.905,-3.315; 7 3.175,-3.315; 8 4.445,-3.315; 9 4.445,3.315; 10 3.175,3.315; 11 1.905,3.315; 12 0.635,3.315; 13 -0.635,3.315; 14 -1.905,3.315; 15 -3.175,3.315; 16 -4.445,3.315
8-SMD = smd 1.3 x 1.4: 1 -3.96,-4.96; 2 -1.42,-4.96; 3 1.12,-4.96; 4 3.66,-4.96; 5 3.59,4.58; 6 1.05,4.58; 7 -1.49,4.58; 8 -4.03,4.58
SO-08 = smd 0.6 x 2.2: 1 -1.905,-2.6; 2 -0.635,-2.6; 3 0.635,-2.6; 4 1.905,-2.6; 5 1.905,2.6; 6 0.635,2.6; 7 -0.635,2.6; 8 -1.905,2.6
POWERS0-10 = smd 2 x 0.7: C_SENSE -6.5,0; GND -6.5,2.54; INPUT -6.5,1.27; NC0 6.5,0; NC1 -6.5,-2.54; NC2 -6.5,-1.27; OUT0 6.5,-2.54; OUT1 6.5,-1.27; OUT2 6.5,1.27; OUT3 6.5,2.54 | smd 6.3 x 9.5: VCC 0,0
D-PAK_TO252AA = smd 1 x 1.6: 1 -2.28,-4.8; 3 2.28,-4.8 | smd 5.4 x 6.2: 4 0,2.5
POWERSO20 = smd 1.651 x 0.635: P$1 -6.731,5.715; P$2 -6.731,4.445; P$3 -6.731,3.175; P$4 -6.731,1.905; P$5 -6.731,0.635; P$6 -6.731,-0.635; P$7 -6.731,-1.905; P$8 -6.731,-3.175; P$9 -6.731,-4.445; P$10 -6.731,-5.715; P$11 6.731,-5.715; P$12 6.731,-4.445; P$13 6.731,-3.175; P$14 6.731,-1.905; P$15 6.731,-0.635; P$16 6.731,0.635; P$17 6.731,1.905; P$18 6.731,3.175; P$19 6.731,4.445; P$20 6.731,5.715

### Placement (x,y rotation side)
3.3V  117.2,49.92 90 bottom
5.0V  144.2,49.92 90 bottom
5V  137.7,7.7 180 top
33V  135.7,7.7 180 top
AUX  40,65 0 top
BATT  141.7,7.7 180 top
C1  88,81.5 90 top
C2  88,78 90 top
C3  88,74.5 90 top
C100  154,30 90 bottom
C101  146,30 90 bottom
C102  134,30 90 bottom
C103  126,30 90 bottom
C104  153,70 270 bottom
C105  145,70 270 bottom
CAM1  81.17,4.95 180 top
CAM2  79.15,4.95 180 top
CAM_PWR  83.05,4.99 180 top
CAMERA1  105,25 180 top
CAMERA2  35,45 180 top
D1  113.2,51.92 0 top
D2  137.2,51.92 0 top
D3  143.2,43.92 90 top
JP1  10,80 0 top
JP2  10,75 0 top
JP3  10,20 0 top
JP4  10,15 0 top
LAUNCH  69,5 180 top
LAUNCHER1  105,10 180 top
LAUNCHER2  35,30 180 top
MAIN  139.7,7.7 180 top
POWER  115,90 0 top
PRB1_CON  73.5,5 180 top
PRB1_TRG  75,5 180 top
PRB2_CON  70.5,5 180 top
PRB2_TRG  72,5 180 top
Q1  135.2,45.92 0 top
Q2  139.2,44.92 0 top
Q3  146.2,42.92 270 top
R1  91,72 270 top
R2  109,72 270 top
R3  126,72 270 top
R4  86,59 270 top
R5  102,61 270 top
R6  107,68 0 top
R7  125,68 0 top
R8  142,68 0 top
R9  124.2,43.92 180 top
R10  135.2,42.92 180 top
R11  139.2,41.92 180 top
R12  143.2,46.92 180 top
R13  144.2,49.92 90 top
R14  150.2,42.92 90 top
R15  152.2,42.92 270 top
R16  33.7,38.81 270 top
R17  139.2,39.92 180 top
R18  103.66,18.81 270 top
R19  69,8.5 90 top
R20  70.5,8.5 90 top
R21  72,8.5 90 top
R22  73.5,8.5 90 top
R23  75,8.5 90 top
R24  79.15,8.26 90 top
R25  81.17,8.26 90 top
R26  83.05,8.3 90 top
R27  135.7,4.2 270 top
R28  137.7,4.2 270 top
R29  139.7,4.2 270 top
R30  141.7,4.2 270 top
TELEM  55,90 0 top
U1  81,77 90 top
U2  99,72 270 top
U3  117,72 270 top
U4  134,72 270 top
U5  94,59 90 top
U6  73.01,50.44 180 top
U7  95,42 270 top
U8  125.2,50.92 0 top
U9  149.2,50.92 0 top
U$9  72.06,33.04 180 top

### Tracks (layer width: path | path; a pad name or v marks a point on that pad's centre or on a via)
3.3V  (via drill 0.6)
  Top 0.254: R18.2 104.24,17.68 104.65,17.68 104.65,15.65 106.88,13.41 112.98,13.41 112.98,9.14 LAUNCHER1.9 113.79,8.74 135.13,8.74 33V.A | v32.31,38 33.12,38 R16.2
  Top 1.016: U6.2 73.66,54.61 | 73.41,54.61 72.39,54.61 U6.3 73.41,53.04 73.41,54.61 | 73.66,54.61 73.41,54.61 | 3.3V.VOUT+ 127.39,39.76 127.51,39.88 127,40.39 122.43,40.39 119.89,42.93 111,42.93 102.11,51.82 86.61,51.82 83.06,55.37 74.42,55.37 73.66,54.61
  Bottom 0.254: 32.31,37.85 v32.31,38
  Bottom 1.778: JP3.15 45.52,20 45.52,19.91 | JP3.15 JP3.16 48.01,20 48.01,28.45 | 42.88,20 JP3.14 | JP3.15 42.88,20 | 42.88,20 42.88,19.91 | LAUNCHER2.9 48.01,28.58 48.01,28.45 | 120.14,32.4 119.89,32.4 119.89,8.64 113.03,8.64 113.03,8.58 LAUNCHER1.9 | 120.14,32.4 C102.+ | AUX.20 3.81,66.42 3.81,37.85 32.31,37.85 48.01,37.85 48.01,32.4 | 48.01,32.4 48.01,28.45 | 48.01,32.4 57.52,32.4 60.45,29.46 66.04,29.46 68.83,32.26 120.14,32.26 120.14,32.4
  Bottom 3.81: 3.3V.VOUT+ 125.98,39.76 125.98,32.4 | 125.98,32.4 C103.+ | C102.+ 125.98,32.4
5V  (via drill 0.6)
  Top 0.254: v110.54,76 104.24,76 U2.8 103.02,75.79 101.8,75.79 101.8,65.23 104.04,62.99 104.04,57.1 100.38,53.44 89.81,53.44 v89.61,53.03 89.61,54.46 U5.8 | v120.09,76 120.9,76 U3.8 | v137.16,76.2 137.97,76.2 U4.8 | v14.63,68.28 14.63,64.01 AUX.1 | 5V.A 137.16,9.35 136.75,9.35 136.75,10.36 135.33,11.79 118.87,11.79 | v89.61,47.35 90.83,46.13 90.83,45.11 U7.VCC | v75.79,72.34 76.81,72.34 U1.16 | AUX.23 25.4,66.85 26.42,66.85 26.42,67.87 51.21,67.87 51.21,64.82 53.24,64.82 53.24,64.01 AUX.15 | 56.64,42.88 56.69,42.88 56.69,42
  Top 1.778: U7.VCC 82.04,42 82.04,41.91 80.01,43.94 71.88,43.94 71.37,44.45 59.44,44.45 56.99,42 56.69,42 44.7,42 44.7,31.42 | 44.7,31.42 LAUNCHER2.1 | 44.7,31.42 51.56,31.42 51.56,14.99 48.01,14.99 48.01,15 JP4.16 | LAUNCHER1.1 118.87,11.42 118.87,11.79 118.87,34.8
  Top 2.54: AUX.16 56.64,63.58 56.64,42.88 56.64,42.42 | 118.62,34.8 101.35,34.8 101.35,41.91 95,41.91 U7.VCC | 118.62,34.8 118.87,34.8 | 118.62,34.8 154.18,34.8 154.18,39.88 154.3,39.76 5.0V.VOUT+
  Bottom 0.254: v110.54,76 v120.09,76 120.29,76.4 136.96,76.4 v137.16,76.2 | v14.63,68.28 22.76,68.28 23.57,67.46 23.57,67.06 24.38,67.06 AUX.23 | v89.61,47.35 v89.61,53.03 | v75.79,72.34 68.68,65.23 60.96,65.23 60.25,65.56
  Bottom 1.778: JP4.16 JP4.15 45.52,15 45.52,15.04 | AUX.16 AUX.15 | AUX.16 56.64,63.5 | AUX.16 59.1,63.58 59.18,63.5 59.26,63.58 AUX.17 60.25,65.56 60.71,66.55 AUX.36
  Bottom 2.54: C101.+ 154.18,32.4 154.18,39.88 154.3,39.76 5.0V.VOUT+
  Bottom 3.81: 153.92,32.4 C100.+ 154.18,32.4 154.43,32.4 | C101.+ 153.92,32.4 | 153.92,32.4 153.92,32.51
BASE_RST
  Bottom 0.254: AUX.25 30.28,67.06 30.28,69.29 22.35,69.29 18.29,73.36 18.29,74.17 18.09,74.17 JP2.4
BASE_RXD
  Bottom 0.254: AUX.27 35.76,67.06 35.76,70.51 24.38,70.51 21.34,73.56 21.34,74.17 20.52,74.17 JP2.5
BASE_TXD  (via drill 0.6)
  Top 0.254: v15.65,72.95 v19.91,72.95 | v6.91,70.51 6.5,70.92 6.5,80.26 8.94,82.7 17.27,82.7 17.27,80.87 JP1.4
  Bottom 0.254: v19.91,72.95 22.96,69.9 32.92,69.9 32.92,67.06 AUX.26 | v15.65,72.95 13.21,70.51 v6.91,70.51
BATTERY_BACKUP  (via drill 0.6)
  Top 0.254: R15.1 152.2,44.09 152.2,45.97
  Top 2.54: AUX.22 22.1,66.45 22.1,70.36 81.03,70.36 81.03,65.79 v93.98,65.79 v95.25,65.79 v96.52,65.79 v97.79,65.79 v99.06,65.79 | v155.19,56.13 v155.19,54.86 v155.19,53.59 v155.19,52.32 v155.19,51.05 155.19,45.97 152.2,45.97 151.48,45.97 | 151.48,45.97 151.38,45.97 | 151.48,45.97 U9.3
  Bottom 2.54: 93.22,65.79 v93.98,65.79 v95.25,65.79 v96.52,65.79 v97.79,65.79 v99.06,65.79 99.06,56.13 v155.19,56.13 | 155.19,50.55 v155.19,51.05 v155.19,52.32 v155.19,53.59 | v155.19,54.86 v155.19,53.59 | v155.19,56.13 v155.19,54.86 | v155.19,56.13 v155.19,54.86 | v155.19,54.86 v155.19,53.59
CAM1_1  (via drill 0.6)
  Top 0.254: v105.46,18.09 108.31,20.93 108.31,23.16 108.51,23.16 CAMERA1.6 | v56.08,11.79 54.46,11.79 53.24,10.57 28.25,10.57 28.25,14.22 JP4.8
  Bottom 0.254: v105.46,18.09 100.79,13.41 57.71,13.41 v56.08,11.79
CAM1_2  (via drill 0.6)
  Top 0.254: v103.63,30.48 106.27,27.84 106.27,24.18 CAMERA1.7 | v69.9,36.58 v69.9,30.48 | v39.83,41.05 34.75,35.97 34.75,30.07 33.53,30.07 33.53,27.43 30.68,27.43 30.68,20.93 JP3.9
  Bottom 0.254: v69.9,30.48 v103.63,30.48 | v69.9,36.58 66.04,40.44 40.44,40.44 v39.83,41.05
CAM2_1  (via drill 0.6)
  Top 0.254: v17.07,39.83 7.92,30.68 7.92,19.1 9.96,17.07 17.27,17.07 17.27,15.85 JP4.4
  Bottom 0.254: v17.07,39.83 35.15,39.83 36.98,41.66 39.22,41.66 39.22,42.88 CAMERA2.6
CAM2_2  (via drill 0.6)
  Top 0.254: v21.95,40.84 21.74,40.64 21.74,28.04 20.12,26.42 20.12,20.93 JP3.5
  Bottom 0.254: v21.95,40.84 31.7,40.84 32.51,41.66 36.17,41.66 36.17,42.88 CAMERA2.7
CAM_PWR  (via drill 0.6)
  Top 0.254: U6.8 74.78,47.95 73.76,47.95 U6.7 73.36,47.95 72.54,47.95 U6.6 72.34,46.94 v72.34,45.92 | v83.11,29.46 82.5,30.07 v82.5,39.01
  Bottom 0.254: CAMERA2.1 41.05,46.13 72.14,46.13 v72.34,45.92 72.75,45.72 79.45,39.01 v82.5,39.01 | v83.11,29.46 110.54,29.46 110.54,27.03 CAMERA1.1
CAM_PWR_EN  (via drill 0.6)
  Top 0.254: v70.92,51.21 70.92,52.02 U6.4 | v17.07,45.52 12.39,40.84 7.32,40.84 7.32,14.63 9.14,12.8 19.71,12.8 19.71,14.22 JP4.5
  Bottom 0.254: v70.92,51.21 22.76,51.21 v17.07,45.52
CAM_STAT_1  (via drill 0.6, 0.61)
  Top 0.254: v24.59,24.18 24.59,23.98 26.82,21.74 26.82,20.52 27.03,20.52 JP3.8 | v77.83,8.33 81.08,8.33 81.08,8.94 R25.2 81.28,9.55 v81.28,22.76 | v6.1,12.8 2.03,16.87 2.03,90.83 8.13,96.93 59.13,96.93 63.2,92.86 63.2,89.2 TELEM.13
  Bottom 0.254: v24.59,24.18 23.57,25.2 10.77,25.2 6.71,21.13 6.71,12.8 | 6.71,12.8 6.71,11.18 34.34,11.18 37.19,8.33 v77.83,8.33 | v81.28,22.76 81.48,22.96 90.02,22.96 95.3,28.25 106.88,28.25 107.09,28.04 107.09,26.82 CAMERA1.2 | v6.1,12.8 6.71,12.8
CAM_STAT_2  (via drill 0.6, 0.61)
  Top 0.254: v76,15.04 78.64,12.39 78.64,9.55 R24.2 | v19.71,42.88 19.71,36.98 19.3,36.58 19.3,33.93 18.9,33.53 18.9,22.96 17.88,21.95 17.88,20.93 JP3.4 | v60.15,72.34 60.15,72.75 58.93,73.97 58.93,77.62 59.94,78.64 59.94,88.19 TELEM.12 | v66.24,66.24 66.24,64.82 66.65,64.41 66.65,56.08 60.96,50.39 60.96,49.17 v58.93,47.14
  Bottom 0.254: v76,15.04 73.15,17.88 19.3,17.88 18.69,18.49 18.69,19.1 17.88,19.1 JP3.4 | 36.98,47.55 36.98,46.74 CAMERA2.2 | 36.98,47.55 24.38,47.55 v19.71,42.88 | v66.24,66.24 v60.15,72.34 | v58.93,47.14 58.93,47.55 36.98,47.55
DEPLOY1  (via drill 0.6)
  Top 0.254: v45.11,94.28 43.69,92.86 43.69,89.81 42.67,89.81 42.67,80.87 JP1.14
  Bottom 0.254: v45.11,94.28 69.09,94.28 69.09,89.2 TELEM.15
DEPLOY2  (via drill 0.6)
  Top 0.254: v60.55,76.81 70.71,86.97 70.71,88.19 70.92,88.19 TELEM.16
  Bottom 0.254: v60.55,76.81 49.38,76.81 49.17,76.61 49.17,76.4 46.13,76.4 46.13,75.79 45.92,75.79 JP2.15
FLIGHT  (via drill 0.6)
  Top 0.254: v143.46,53.85 143.46,54.05 144.07,54.66 144.07,61.16 143.46,61.77 143.46,67.26 R8.2 | v90.22,36.17 88.39,34.34 v88.39,18.49 | v52.83,12.19 40.84,12.19 40.84,14.22 JP4.13
  Bottom 0.254: v143.46,53.85 132.28,42.67 104.85,42.67 98.35,36.17 v90.22,36.17 | v88.39,18.49 83.92,14.02 57.1,14.02 55.27,12.19 v52.83,12.19
FLIGHT_TRIG
  Top 0.254: U4.2 128.42,73.97 126.8,73.97 126.8,74.98 114.61,87.17 114.2,87.17 114.2,88.19 POWER.4
GND  (via drill 0.6)
  Top 0.254: v26.01,33.53 v26.01,42.88 | v19.91,33.33 19.51,33.33 19.51,27.84 v19.91,27.43 | v6.1,27.43 6.1,14.02 8.94,11.18 9.75,11.18 v10.77,10.16 | v20.93,10.16 v20.93,12.8 | v66.24,7.32 v66.24,11.79 | v5.49,53.44 4.88,53.44 2.64,55.68 2.64,82.91 8.33,88.59 9.55,88.59 v10.77,89.81 | v25.81,89.81 26.01,89.61 26.01,84.53 | 26.01,84.53 v26.01,83.92 | 26.01,84.53 26.42,84.53 v29.06,81.89
  Bottom 0.254: v26.01,33.53 25.81,33.33 v19.91,33.33 v17.88,33.33 | v6.1,27.43 v19.91,27.43 | v10.77,10.16 11.18,10.57 20.52,10.57 v20.93,10.16 21.13,10.57 34.14,10.57 36.98,7.72 65.84,7.72 v66.24,7.32 | v66.24,11.79 66.65,11.38 72.14,11.38 72.54,11.79 | v21.95,53.85 17.27,53.85 16.87,53.44 v5.49,53.44 | v10.77,89.81 v25.81,89.81
  other vias: 11.43,72.39 19.56,69.6 16.76,69.85 30.23,50.04 31.75,50.04 33.27,50.04 34.8,50.04 16.26,48.51 16,42.16 12.19,44.2 19.56,52.83 21.84,43.69 25.15,46.48 45.97,50.04 46.99,55.37 54.1,55.37 54.1,60.2 48.51,60.2 59.94,50.04 61.98,50.04 63.75,50.04 76.71,52.83 78.23,52.83 79.76,52.83 63.5,38.61 63.5,37.08 61.98,38.61 61.98,37.08 72.9,28.96 72.9,26.42 76.45,26.16 76.45,28.96 69.34,28.7 69.6,26.42 80.77,36.32 76.2,39.62 68.83,39.62 70.61,38.61 26.31,82.14 10.06,73 10.67,69.34 11.68,68.33 61.21,34.04 62.74,34.04 64.01,25.15 62.74,25.15 61.47,25.15 68.07,23.11 67.06,22.35 63.75,15.49 76.45,11.68 93.47,14.99 88.9,14.48 85.6,17.27 95.5,23.62 93.47,27.69 139.45,15.75 126.49,15.24 126.49,23.11 138.18,23.37 34.14,78.08 32.87,78.08 31.6,78.08 30.33,78.08 61.21,42.16 63.5,42.16 57.91,28.7
  pour Bottom: 0,0 160,0 160,100 0,100
  pour Top (isolate 0.254, rank 6): 0,0 160,0 160,100 0,100
GPIO0  (via drill 0.6)
  Top 0.254: v35.76,57.1 38.41,59.74 38.41,65.84 AUX.28 | v15.44,57.1 5.69,66.85 5.69,80.26 8.74,83.31 19.71,83.31 19.71,80.87 JP1.5
  Bottom 0.254: v15.44,57.1 v35.76,57.1
GPIO1
  Bottom 0.254: AUX.29 41.25,67.06 41.25,71.12 25.81,71.12 23.57,73.36 23.57,74.17 23.16,74.17 JP2.6
GPIO2  (via drill 0.6)
  Top 0.254: v43.89,60.76 43.89,65.84 AUX.30 | v13.01,60.76 7.92,65.84 v7.92,71.53 | v8.13,77.22 11.79,77.22 11.79,77.01 11.99,76.81 12.19,76.81 12.19,76.61 14.22,76.61 14.22,76.81 15.24,77.83 22.15,77.83 22.15,79.25 JP1.6
  Bottom 0.254: v13.01,60.76 v43.89,60.76 | v7.92,71.53 7.92,74.98 7.11,75.79 7.11,77.22 v8.13,77.22
GPIO3  (via drill 0.6)
  Top 0.254: v46.74,61.77 47.14,62.18 47.14,65.84 AUX.31 | v19.71,61.77 19.1,62.38 19.1,65.23 18.09,65.23 18.09,69.7 21.34,72.95 24.79,72.95 24.79,74.17 JP2.7
  Bottom 0.254: v19.71,61.77 v46.74,61.77
LAUNCH  (via drill 0.6)
  Top 0.254: v105.66,49.99 105.66,50.6 104.65,51.61 104.65,61.16 107.49,64.01 107.49,67.26 R6.2 | v87.38,19.51 v87.38,35.56 | v58.32,18.9 52.22,12.8 43.48,12.8 43.48,14.43 42.93,14.99 42.94,15 JP4.14
  Bottom 0.254: v105.66,49.99 102.62,46.94 98.75,46.94 v87.38,35.56 | v87.38,19.51 86.77,18.9 v58.32,18.9
LAUNCH_TRIG  (via drill 0.6)
  Top 0.254: v95.5,73.97 94.69,73.97 U2.2 | R10.2 133.91,43.08 132.69,43.08 132.69,47.14 134.52,48.97 136.14,48.97 136.14,54.46 131.06,59.54 131.06,62.18 127,66.24 127,69.09 126.8,69.09 126.8,69.29 124.56,69.29 124.56,71.12 124.36,71.12 124.36,71.32 123.34,71.32 123.34,77.62 114.4,86.56 111.35,86.56 111.35,87.99 POWER.3
  Bottom 0.254: v95.5,73.97 108.51,86.97 108.51,87.99 POWER.2 108.71,88.8 110.13,88.8 POWER.3
LAUNCHER_EN  (via drill 0.6)
  Top 0.254: 66.45,12.8 68.48,10.77 68.48,9.75 R19.2 | 66.45,12.8 53.85,12.8 53.85,11.99 53.03,11.18 30.68,11.18 30.68,14.22 JP4.9 | v96.32,46.74 96.32,47.55 U7.INPUT | v73.36,36.58 70.92,34.14 70.92,24.59 66.45,20.12 66.45,12.8
  Bottom 0.254: v96.32,46.74 87.38,37.8 78.03,37.8 77.42,38.41 75.18,38.41 v73.36,36.58
LIGHT1  (via drill 0.6)
  Top 0.254: v52.83,72.54 52.83,88.19 TELEM.9 | v26.52,78.03 27.74,76.81 31.14,76.81 32.51,75.44 32.48,75.41 | 32.48,75.41 JP2.10 | 32.48,75.41 32.31,75.59
  Bottom 0.254: v52.83,72.54 52.83,72.14 57.1,67.87 57.51,67.87 57.51,66.85 AUX.35 | v26.52,78.03 14.02,78.03 13.61,78.44 13.61,78.64 11.38,78.64 10.77,78.03 9.14,78.03 7.92,79.25 7.92,88.59 26.21,88.59 30.89,93.27 51.61,93.27 52.02,92.86 52.02,89.2 TELEM.9
LIGHT2  (via drill 0.6)
  Top 0.254: v51.41,72.54 51.41,82.91 49.78,84.53 | 49.78,84.53 49.58,84.73 49.58,87.99 TELEM.8 | v30.68,83.92 30.68,80.87 JP1.9 | v49.38,84.12 49.78,84.53
  Bottom 0.254: v51.41,72.54 54.86,69.09 55.07,69.09 55.07,67.06 AUX.34 | v30.68,83.92 47.55,83.92 47.75,84.12 v49.38,84.12
LIGHT3  (via drill 0.6)
  Top 0.254: v54.46,85.75 54.86,85.34 54.86,75.79 | 54.86,75.79 v54.86,72.34 | v58.32,68.28 53.03,68.28 53.03,66.85 AUX.33 | 49.78,76.96 v49.78,75.79 | 49.78,76.96 49.78,77.01 | v54.66,75.79 54.86,75.79 | v36.73,78.28 48.46,78.28 49.78,76.96
  Bottom 0.254: v54.46,85.75 49.78,85.75 48.36,87.17 47.35,87.17 47.35,88.19 TELEM.7 | v54.86,72.34 58.32,68.89 v58.32,68.28 | v49.78,75.79 v54.66,75.79 | JP2.9 30.68,75.79 30.68,77.01 35.36,77.01 36.63,78.28 v36.73,78.28
LIGHT4  (via drill 0.6)
  Top 0.254: v50.19,72.54 50.39,72.54 50.39,75.18 50.8,75.59 50.8,81.48 48.56,83.72 | 48.56,83.72 45.11,87.17 44.5,87.17 44.5,88.19 TELEM.6 | v47.95,83.11 48.56,83.72
  Bottom 0.254: v50.19,72.54 49.78,72.54 49.78,67.06 AUX.32 | v47.95,83.11 34.34,83.11 34.14,82.91 28.04,82.91 28.04,80.87 JP1.8
M1+  (via drill 0.6)
  Top 0.254: v72.34,40.03 76.81,35.56 76.81,34.95 78.03,34.95 U$9.P$7 | v25.2,43.89 24.99,43.69 24.99,33.73 23.57,32.31 23.57,28.65 v25.81,26.42 | v32.92,26.42 32.92,20.93 JP3.10
  Bottom 0.254: v72.34,40.03 73.36,39.01 73.76,39.01 74.57,39.83 74.57,42.93 71.48,42.93 68.89,45.52 42.06,45.52 41.25,44.7 29.46,44.7 28.65,43.89 v25.2,43.89 | v32.92,26.42 v25.81,26.42
M1-  (via drill 0.6)
  Top 0.254: v77.22,37.39 78.03,37.39 U$9.P$9 | v58.93,34.14 55.68,30.89 v55.68,24.79
  Bottom 0.254: v77.22,37.39 75.39,35.56 60.35,35.56 v58.93,34.14 | v55.68,24.79 49.58,18.69 38.61,18.69 38.61,19.1 38.2,19.1 JP3.12
M1_LIM1  (via drill 0.6)
  Top 0.254: v96.32,4.47 98.75,6.91 98.75,8.33 LAUNCHER1.14 | v21.13,26.21 22.35,24.99 22.35,20.93 JP3.6
  Bottom 0.254: v96.32,4.47 96.11,4.67 6.71,4.67 4.67,6.71 4.67,26.21 v21.13,26.21
M1_LIM2
  Top 0.254: LAUNCHER1.15 96.11,8.74 84.73,8.74 84.73,2.85 84.12,2.23 23.16,2.23 23.16,14.22 JP4.6
M1OUT+  (via drill 0.6)
  Top 0.254: v80.26,12.39 80.26,22.96 80.67,23.37 80.67,31.09 79.45,31.09 U$9.P$4
  Bottom 0.254: v80.26,12.39 82.7,9.96 84.53,9.96 87.78,6.71 100.18,6.71 100.99,7.52 100.99,7.92 102.01,7.92 LAUNCHER1.13
M1OUT-  (via drill 0.6)
  Top 0.254: v82.91,12.39 82.91,22.35 81.28,23.98 81.28,32.31 79.45,32.31 U$9.P$5
  Bottom 0.254: v82.91,12.39 85.75,9.55 95.3,9.55 95.5,9.75 103.83,9.75 103.83,9.14 104.65,9.14 LAUNCHER1.12
M2+  (via drill 0.6)
  Top 0.254: v58.93,15.85 67.87,24.79 67.87,36.17 66.04,36.17 U$9.P$13
  Bottom 0.254: v58.93,15.85 51.82,15.85 48.97,13.01 39.22,13.01 38.81,13.41 38.81,14.22 38.41,14.22 JP4.12
M2-  (via drill 0.6)
  Top 0.254: v54.46,13.82 66.65,26.01 66.65,33.53 66.04,33.53 U$9.P$15
  Bottom 0.254: v54.46,13.82 53.85,13.21 50.8,13.21 49.38,11.79 35.36,11.79 33.73,13.41 33.73,14.22 33.33,14.22 JP4.10
M2_LIM1  (via drill 0.6)
  Top 0.254: v28.04,22.76 29.46,24.18 29.46,27.84 LAUNCHER2.14
  Bottom 0.254: v28.04,22.76 27.23,21.95 14.02,21.95 13.61,21.54 13.61,20.93 12.8,20.93 JP3.2
M2_LIM2  (via drill 0.6)
  Top 0.254: v26.82,22.96 26.82,27.84 LAUNCHER2.15
  Bottom 0.254: v26.82,22.96 26.42,22.55 9.75,22.55 7.92,20.73 7.92,17.07 10.77,17.07 11.38,16.46 11.38,15.85 12.19,15.85 JP4.2
M2OUT+  (via drill 0.6)
  Top 0.254: v54.86,39.42 59.94,34.34 59.94,32.51 64.62,32.51 U$9.P$16 | v39.83,39.83 37.39,37.39 v37.39,33.53
  Bottom 0.254: v54.86,39.42 54.46,39.83 v39.83,39.83 | v37.39,33.53 37.19,33.33 33.12,33.33 32.51,32.72 32.51,29.26 LAUNCHER2.13
M2OUT-  (via drill 0.6)
  Top 0.254: v56.9,30.48 56.9,31.09 64.62,31.09 U$9.P$17 | v49.78,29.46 43.89,29.46 43.89,29.67 43.69,29.67 43.69,29.87 43.08,29.87 v43.08,30.28
  Bottom 0.254: v56.9,30.48 55.88,29.46 v49.78,29.46 | v43.08,30.28 36.58,30.28 36.58,29.26 35.36,29.26 LAUNCHER2.12
MAIN_PWR
  Top 0.254: POWER.1 106.27,89.41
  Top 2.54: 125.2,53.59 125.22,53.59 | 125.2,53.59 U8.4 | 125.2,53.59 124.71,53.59 124.71,62.99 116.59,62.99 116.59,81.03 105.4,81.03 POWER.1 105.41,88.57 | 105.41,88.57 105.41,88.39 | POWER.9 105.41,90.06 105.41,88.57
  pour Top: 122.2,42.92 124.2,42.92 124.2,45.92 129.2,50.92 129.2,56.92 121.2,56.92 119.2,54.92 114.2,54.92 114.2,48.92 118.2,48.92 122.2,44.92
MISO  (via drill 0.6)
  Top 0.254: v20.73,35.56 20.93,35.76 20.93,62.99 AUX.3 | v54.86,20.12 54.66,20.32 54.66,32.11 v52.43,34.34 | v49.78,34.14 46.33,34.14 v46.33,33.93 | v12.6,77.62 12.6,79.25 JP1.2 | v8.13,76 7.92,75.79 7.92,73.56 9.65,71.83 9.65,66.55 v11.99,64.21
  Bottom 0.254: 39.01,33.93 39.01,34.54 21.74,34.54 v20.73,35.56 | 39.01,33.93 39.01,32.11 LAUNCHER2.3 | v54.86,20.12 55.27,20.52 87.58,20.52 89,19.1 108.71,19.1 108.71,11.99 LAUNCHER1.3 | v52.43,34.34 49.99,34.34 v49.78,34.14 | 39.01,33.93 v46.33,33.93 | v12.6,77.62 11.99,77.01 9.14,77.01 v8.13,76 | v11.99,64.21 14.43,61.77 18.49,61.77 18.69,61.98 18.69,62.79 20.12,62.79 20.12,63.2 AUX.3
MOSI  (via drill 0.6)
  Top 0.254: v42.06,36.17 42.06,32.11 LAUNCHER2.2 42.06,30.68 42.06,27.43 v49.78,27.43 | v17.88,36.17 18.09,36.37 18.09,61.77 | 18.09,61.77 18.09,62.99 AUX.2 | 18.09,61.77 14.22,61.77 13.01,62.99 13.01,74.17 JP2.2
  Bottom 0.254: v42.06,36.17 42.06,36.58 17.88,36.58 v17.88,36.17 | v49.78,27.43 66.85,27.43 72.54,21.74 111.76,21.74 111.76,11.99 LAUNCHER1.2
N$1  (via drill 0.6)
  Top 0.254: v80.26,40.03 81.89,38.41 81.89,29.46 83.92,27.43 83.92,12.19 83.52,11.79 83.52,9.55 R26.2 | v69.9,47.14 70.92,47.14 U6.5
  Bottom 0.254: v80.26,40.03 73.15,47.14 v69.9,47.14
N$2
  Top 0.254: CAM_PWR.A 83.11,6.5 83.11,7.11 R26.1
N$3
  Top 0.254: CAM1.A 81.28,6.5 81.28,7.11 R25.1
N$4
  Top 0.254: CAM2.A 79.25,6.5 79.25,7.11 R24.1
N$6
  Top 0.254: Q1.2 136.35,44.91 137.97,44.91 137.97,44.3 Q2.1 138.18,43.48 138.18,42.47 R11.2
N$7
  Top 0.254: U5.3 99.57,60.15 101.4,60.15 R5.2
N$8
  Top 2.54: U8.3 127.51,46.15 127.51,46.23 127.81,46.23 D2.C
N$9
  Top 0.254: U5.6 88.8,60.15 86.77,60.15 R4.1
N$16  (via drill 0.6)
  Top 0.254: v133.71,46.94 134.93,46.94 Q1.3 | v126.39,43.89 125.37,43.89 R9.1
  Bottom 0.254: v133.71,46.94 130.66,43.89 v126.39,43.89
N$18
  Top 0.254: Q1.1 134.52,44.91 135.33,44.91 135.33,44.09 136.14,44.09 136.14,43.48 R10.1 136.14,42.47 136.14,41.25 136.55,40.84 136.55,40.03 137.97,40.03 R17.2
N$19
  Top 0.254: D3.1 143.46,43.08 146.91,43.08 Q3.3
N$23
  Top 0.254: R14.2 149.76,44.09 147.12,44.09 147.12,45.52 U9.1
N$25  (via drill 0.6)
  Top 0.254: U7.OUT3 97.33,35.56 96.52,35.56 U7.OUT2 96.11,35.15 95.71,34.75 95.71,34.14 94.28,34.14 94.28,34.75 93.88,34.75 U7.OUT1 93.47,35.56 92.66,35.56 U7.OUT0 92.25,34.95 v90.22,34.95 | v68.89,34.54 68.89,37.39 66.04,37.39 U$9.P$12 | v76.2,34.34 77.01,33.53 78.03,33.53 U$9.P$6
  Bottom 0.254: v68.89,34.54 69.09,34.34 v76.2,34.34 76.61,34.54 89.81,34.54 v90.22,34.95
N$26
  Top 0.254: Q3.1 144.88,44.09 144.68,44.09 144.68,46.74 144.47,46.74 R12.1 144.07,47.35 144.07,48.77 R13.1
N$38
  Top 0.254: U2.3 93.47,70.92 91.64,70.92 R1.2
N$39
  Top 0.254: U4.3 128.42,70.92 126.8,70.92 R3.2
N$40
  Top 0.254: U3.3 111.35,70.92 109.73,70.92 R2.2
N$41
  Top 0.254: U3.6 122.12,70.71 123.95,70.71 123.95,68.68 R7.1
N$43
  Top 0.254: U2.6 104.24,70.71 105.87,70.71 105.87,68.68 R6.1
N$44
  Top 0.254: R15.2 151.79,42.06 150.77,42.06 R14.1 149.76,41.86 148.54,41.86 148.54,40.64 145.29,37.39 141.63,37.39 141.63,44.91 | 141.63,44.91 141.43,44.91 141.43,45.11 140.61,45.92 139.6,45.92 Q2.3 | 141.63,44.91 142.85,44.91 D3.2
N$48
  Top 0.254: R27.1 135.74,5.49 135.74,6.1 33V.C
N$49
  Top 0.254: R28.1 137.77,5.49 137.77,6.1 5V.C
N$50
  Top 0.254: R29.1 139.8,5.49 139.8,6.1 MAIN.C
N$51
  Top 0.254: R30.1 141.83,5.49 141.83,6.1 BATT.C
N$52
  Top 0.254: LAUNCH.A 69.09,6.5 69.09,7.32 R19.1
N$54
  Top 0.254: C3.1 87.58,73.36 85.75,73.36 85.75,73.15 84.94,73.15 84.94,72.75 U1.1
N$55
  Top 0.254: C3.2 87.58,75.18 85.14,75.18 U1.3
N$56
  Top 0.254: C2.2 87.58,78.64 85.75,78.64 85.75,78.23 84.94,78.23 84.94,77.83 U1.5
N$57
  Top 0.254: C2.1 87.58,77.01 85.55,77.01 85.55,76.4 85.14,76.4 U1.4
N$58
  Top 0.254: C1.1 88.59,80.67 89.81,80.67 89.81,74.78 89.61,74.57 85.75,74.57 85.75,74.37 84.94,74.37 84.94,73.97 U1.2
N$59
  Top 0.254: C1.2 87.58,82.3 85.75,82.3 85.75,79.45 84.94,79.45 84.94,79.05 U1.6
N$60
  Top 0.254: PRB1_TRG.A 75.18,6.5 75.18,7.32 R23.1
N$61
  Top 0.254: PRB1_CON.A 73.56,6.5 73.56,7.32 R22.1
N$62
  Top 0.254: PRB2_TRG.A 72.14,6.5 72.14,7.32 R21.1
N$63
  Top 0.254: PRB2_CON.A 70.51,6.5 70.51,7.32 R20.1
N$64
  Top 0.254: U4.6 139.19,70.71 140.82,70.71 140.82,68.68 R8.1
PAYLOAD_CHK  (via drill 0.6)
  Top 0.254: v28.45,72.34 42.47,72.34 42.47,74.37 JP2.14
  Bottom 0.254: v28.45,72.34 29.06,71.73 45.31,71.73 45.31,65.23 47.14,65.23 47.14,62.79 47.35,62.79 47.35,62.38 49.38,62.38 50.19,61.57 85.14,61.57 85.14,68.28 66.65,86.77 66.24,86.77 66.24,87.99 TELEM.14
PROBE1_CONTACT  (via drill 0.6)
  Top 0.254: v73.97,10.57 73.97,9.75 R22.2 | v23.37,24.18 24.79,22.76 24.79,20.73 JP3.7
  Bottom 0.254: LAUNCHER1.11 107.49,7.92 106.48,7.92 106.48,7.52 105.05,6.1 87.58,6.1 84.33,9.35 75.18,9.35 v73.97,10.57 73.56,10.77 35.56,10.77 34.54,11.79 7.32,11.79 7.32,20.93 10.97,24.59 22.96,24.59 v23.37,24.18
PROBE1_RST  (via drill 0.6)
  Top 0.254: v89.41,26.42 102.82,13.01 102.82,11.79 103.02,11.79 LAUNCHER1.5 | v85.34,27.23 84.12,28.45 v84.12,38.81 | v41.45,50.19 40.03,51.61 40.03,60.96 41.45,62.38 v41.45,62.79
  Bottom 0.254: v89.41,26.42 88.59,27.23 v85.34,27.23 | v84.12,38.81 74.17,48.77 42.88,48.77 v41.45,50.19 | v41.45,62.79 41.45,62.38 27.64,62.38 27.43,62.59 27.43,62.99 26.62,62.99 AUX.5
PROBE1_RXD  (via drill 0.6)
  Top 0.254: v32.31,56.08 32.31,63.2 AUX.7 | v34.75,56.08 v38.61,52.22 | v86.56,39.01 86.36,38.81 86.36,19.3 92.25,13.41 97.54,13.41 97.54,11.79 LAUNCHER1.7
  Bottom 0.254: v32.31,56.08 v34.75,56.08 | v38.61,52.22 73.36,52.22 v86.56,39.01
PROBE1_TRIG  (via drill 0.6)
  Top 0.254: v34.95,58.73 34.95,62.99 AUX.8 | v73.36,37.8 74.98,36.17 74.98,9.75 R23.2 75.59,9.35 76.81,9.35 v76.81,7.32 76.81,5.08 32.92,5.08 25.81,12.19 25.81,14.43 JP4.7 | v44.3,55.07 44.3,43.94 v45.47,43.94
  Bottom 0.254: v76.81,7.32 78.64,5.49 107.29,5.49 109.32,7.52 109.32,7.92 110.13,7.92 LAUNCHER1.10 | v34.95,58.73 35.56,58.12 41.25,58.12 v44.3,55.07 | v73.36,37.8 70.1,41.05 48.46,41.05 45.62,43.89 45.62,43.94 v45.47,43.94
PROBE1_TXD  (via drill 0.6)
  Top 0.254: v25.2,50.19 25.2,55.27 28.45,58.52 28.45,63.2 AUX.6 | v81.48,40.03 89.2,40.03 89.2,38.41 90.02,37.59 98.15,37.59 98.15,36.78 98.35,36.78 98.35,27.84 97.33,26.82 97.33,19.91 104.04,13.21 v104.04,13.01
  Bottom 0.254: v25.2,50.19 26.42,48.97 41.86,48.97 42.67,48.16 73.36,48.16 v81.48,40.03 | v104.04,13.01 104.04,12.6 101.4,12.6 101.4,11.99 101.19,11.99 LAUNCHER1.6
PROBE2_CONTACT  (via drill 0.6)
  Top 0.254: v70.31,22.76 70.31,9.75 R20.2 | v45.52,26.01 v49.78,26.01 | v17.07,23.57 15.44,21.95 15.44,20.93 JP3.3
  Bottom 0.254: v70.31,22.76 67.06,26.01 v49.78,26.01 | v45.52,26.01 45.11,25.6 41.05,25.6 39.22,27.43 | 39.22,27.43 39.01,27.64 39.01,27.84 38,27.84 LAUNCHER2.11 | v17.07,23.57 17.48,23.16 25.81,23.16 28.04,25.4 37.19,25.4 39.22,27.43
PROBE2_RST
  Top 0.254: LAUNCHER2.5 32.92,31.7 32.72,31.7 32.72,36.37 29.26,39.83 29.26,42.47 27.64,44.09 27.64,50.19 36.78,59.33 36.78,62.99 AUX.9
PROBE2_RXD  (via drill 0.6)
  Top 0.254: v31.29,59.33 26.21,54.25 26.21,43.89 27.23,42.88 27.23,31.7 27.43,31.7 LAUNCHER2.7 | v41.05,59.74 42.67,61.37 42.67,62.99 AUX.11
  Bottom 0.254: v31.29,59.33 31.7,59.74 v41.05,59.74
PROBE2_TRIG  (via drill 0.6)
  Top 0.254: v71.53,15.04 71.53,9.75 R21.2 | v49.58,16.87 49.58,21.54 46.94,24.18 41.05,24.18 41.05,28.25 LAUNCHER2.10 40.23,29.26 40.23,35.56 42.47,37.8 42.47,54.46 v45.11,57.1 | v45.11,59.94 45.11,62.99 AUX.12
  Bottom 0.254: v71.53,15.04 69.7,16.87 v49.58,16.87 49.17,17.07 15.44,17.07 15.44,15.85 JP4.3 | v45.11,57.1 v45.11,59.94
PROBE2_TXD  (via drill 0.6)
  Top 0.254: v30.28,54.05 27.03,50.8 27.03,43.89 27.84,43.08 27.84,40.44 30.07,38.2 30.07,31.7 30.28,31.7 LAUNCHER2.6 | v38,54.05 39.42,55.47 39.42,63.2 AUX.10
  Bottom 0.254: v30.28,54.05 v38,54.05
PWM1  (via drill 0.6)
  Top 0.254: v73.56,40.03 73.56,39.83 76.81,36.58 76.81,36.37 78.03,36.37 U$9.P$8 | v41.45,41.45 40.84,40.84 40.84,36.98 38.41,34.54 38.41,33.33 37.8,32.72 37.8,30.28 36.58,30.28 36.58,22.76 35.76,21.95 35.76,20.93 JP3.11
  Bottom 0.254: v73.56,40.03 68.68,44.91 44.91,44.91 v41.45,41.45
PWM2  (via drill 0.6)
  Top 0.254: v56.69,14.83 67.26,25.4 67.26,34.95 66.04,34.95 U$9.P$14
  Bottom 0.254: v56.69,14.83 51.61,14.83 49.17,12.39 35.97,12.39 35.15,13.21 35.15,14.22 JP4.11
PWR_FAULT  (via drill 0.6)
  Top 0.254: v84.12,63.8 84.12,58.12 85.34,58.12 R4.2 | v53.85,73.36 53.44,73.76 53.44,89.81 52.43,89.81 52.43,95.3 41.05,95.3 38.61,92.86 38.61,91.64 37.8,91.64 TELEM.22
  Bottom 0.254: v84.12,63.8 76.81,71.12 76.81,73.56 53.85,73.56 | 53.85,73.56 49.99,73.56 49.38,72.95 39.22,72.95 38.81,73.36 38.81,74.17 38.41,74.17 JP2.12 | 53.85,73.56 v53.85,73.36
RFB_PIN  (via drill 0.6)
  Top 0.254: v25.4,59.74 27.84,62.18 27.84,65.84 AUX.24 | v15.24,59.74 8.94,66.04 8.94,71.73 7.11,73.56 7.11,80.06 9.14,82.09 14.63,82.09 14.63,80.87 JP1.3
  Bottom 0.254: v15.24,59.74 v25.4,59.74
RSSI1
  Top 0.254: TELEM.1 30.68,88.19 30.68,85.14 32.51,83.31 32.51,80.87 JP1.10
RSSI2
  Top 0.254: TELEM.2 33.53,88.19 33.73,88.19 33.73,84.12 35.76,82.09 35.76,80.87 JP1.11
SCK  (via drill 0.6)
  Top 0.254: v35.76,35.56 35.76,31.7 LAUNCHER2.4 | v23.98,35.56 23.98,63.2 AUX.4 | v98.35,20.12 105.26,13.21 105.26,11.79 105.66,11.79 LAUNCHER1.4 | v53.65,20.73 53.65,32.31 52.63,33.33 50.8,33.33 50.8,34.34 49.99,35.15 v46.33,35.15 | v17.07,64.82 15.44,64.82 15.44,65.84 15.24,65.84 15.24,67.46 15.85,67.46 15.85,68.48 14.63,69.7 14.63,74.17 JP2.3
  Bottom 0.254: v23.98,35.56 v35.76,35.56 35.97,35.15 v46.33,35.15 | v98.35,20.12 97.33,21.13 54.05,21.13 v53.65,20.73 | v17.07,64.82 21.95,64.82 22.15,64.62 22.15,64.21 23.16,64.21 AUX.4
SCL
  Bottom 0.254: AUX.14 50.6,64.01 50.6,65.23 48.97,65.23 48.97,65.43 48.56,65.43 48.56,72.34 29.67,72.34 28.65,73.36 28.65,74.17 28.25,74.17 JP2.8
SDA  (via drill 0.6)
  Top 0.254: v41.45,55.07 47.75,61.37 47.75,63.2 AUX.13 | v16.26,55.07 5.08,66.24 5.08,80.47 8.53,83.92 24.79,83.92 24.79,80.87 JP1.7
  Bottom 0.254: v16.26,55.07 v41.45,55.07
SEP  (via drill 0.6)
  Top 0.254: v130.45,53.85 130.45,60.76 126.39,64.82 126.39,67.26 R7.2 | v22.96,27.84 v22.96,52.22 | v28.04,27.43 28.45,27.03 v28.45,24.38
  Bottom 0.254: v130.45,53.85 127.61,51 100.79,51 99.16,49.38 94.49,49.38 89.81,54.05 39.22,54.05 37.39,52.22 v22.96,52.22 | v22.96,27.84 23.37,27.43 v28.04,27.43 | v28.45,24.38 30.89,21.95 39.01,21.95 39.42,21.54 39.42,20.93 40.23,20.93 JP3.13
SEP1  (via drill 0.6)
  Top 0.254: v34.54,82.09 31.29,85.34 31.29,90.83 TELEM.20
  Bottom 0.254: v34.54,82.09 48.97,82.09 50.19,80.87 50.19,77.42 48.16,77.42 47.75,77.01 37.19,77.01 36.58,76.4 36.58,75.79 35.76,75.79 JP2.11
SEP2
  Top 0.254: TELEM.21 34.54,90.83 34.54,84.94 37.59,81.89 37.59,80.87 JP1.12
SEP_TRIG  (via drill 0.6)
  Top 0.254: v141.83,32.72 141.83,9.35 BATT.A | v141.83,49.17 141.83,50.19 D2.A 139.6,53.24 136.75,53.24 136.75,60.76 v130.66,66.85 | R13.2 144.27,50.8 144.27,51.82 | v101.19,58.52 101.19,57.71 99.57,57.71 U5.2 | v110.54,73.36 111.35,73.36 U3.2
  Top 2.54: D2.A 141,51.82 144.27,51.82 148.84,51.82 149.1,52.07 149.1,53.34 149.12,53.34 U9.4
  Bottom 0.254: v141.83,32.72 v141.83,49.17 | POWER.10 110.13,91.24 111.56,91.24 POWER.11 112.17,90.83 112.17,77.01 110.34,77.01 109.53,76.2 109.53,73.76 110.34,73.76 v110.54,73.36 110.54,67.87 | 110.54,67.87 v101.19,58.52 | v130.66,66.85 129.64,67.87 110.54,67.87
TELEM_RX  (via drill 0.6)
  Top 0.254: v75.59,76.61 75.59,75.18 76.81,75.18 U1.14
  Bottom 0.254: v75.59,76.61 64.82,87.38 64.82,90.83 TELEM.32
TELEM_TX  (via drill 0.6)
  Top 0.254: v64.62,79.05 76.81,79.05 U1.11 | v51.82,83.72 50.6,84.94 50.6,89.61 50.19,89.61 50.19,89.81 48.36,89.81 48.36,87.17 v47.35,86.16 | v45.31,85.75 45.11,85.55 45.11,80.87 JP1.15
  Bottom 0.254: v64.62,79.05 59.94,83.72 v51.82,83.72 | v47.35,86.16 46.94,85.75 v45.31,85.75
TMP1_+  (via drill 0.6)
  Top 0.254: R18.1 103.83,19.91 103.83,22.96 CAMERA1.8 103.43,24.18 103.43,27.84 98.96,32.31 v98.96,38 | v38.2,95.3 35.97,93.07 35.97,89.2 TELEM.3 | v98.96,45.92 v98.96,50.39
  Bottom 0.254: v38.2,95.3 77.22,95.3 90.83,81.69 90.83,53.85 95.5,53.85 v98.96,50.39 | v98.96,38 v98.96,45.92
TMP2_+  (via drill 0.6)
  Top 0.254: R16.1 33.73,40.03 33.73,42.88 CAMERA2.8 | v8.94,86.77 3.86,81.69 3.86,56.29 v14.63,45.52
  Bottom 0.254: v8.94,86.77 38,86.77 38,87.99 TELEM.4 | v14.63,45.52 18.29,41.86 30.07,41.86 30.28,41.66 31.7,41.66 32.51,42.47 32.51,42.88 33.33,42.88 CAMERA2.8
VIN
  Top 0.254: MAIN.A 140.21,8.33 140.82,7.72 148.54,7.72 148.54,25.81 157.68,34.95 157.68,57.1 155.04,59.74 147.93,59.74 5.0V.VIN+
  Top 2.54: D1.C 109.5,56.64 118.36,56.64 118.36,60.2 119.74,60.2 | 119.74,60.2 119.89,60.2 | 3.3V.VIN+ 119.74,60.2
  Bottom 2.54: 5.0V.VIN+ 146.74,67.56 145,67.56 | C104.+ 153,67.56 145,67.56 | 145,67.56 C105.+ 145,64.26 120.14,64.26 120.14,60.2 119.74,60.2 | 119.74,60.2 119.63,60.2 | 119.74,60.2 3.3V.VIN+

### Text on the board
tPlace: U2 | U3 | U4 | U5 | U7 | u7
bPlace: 5v | 3.3v